# EAGLE design doorbell (EAGLE 6.3)

## Sheet 1 of 9
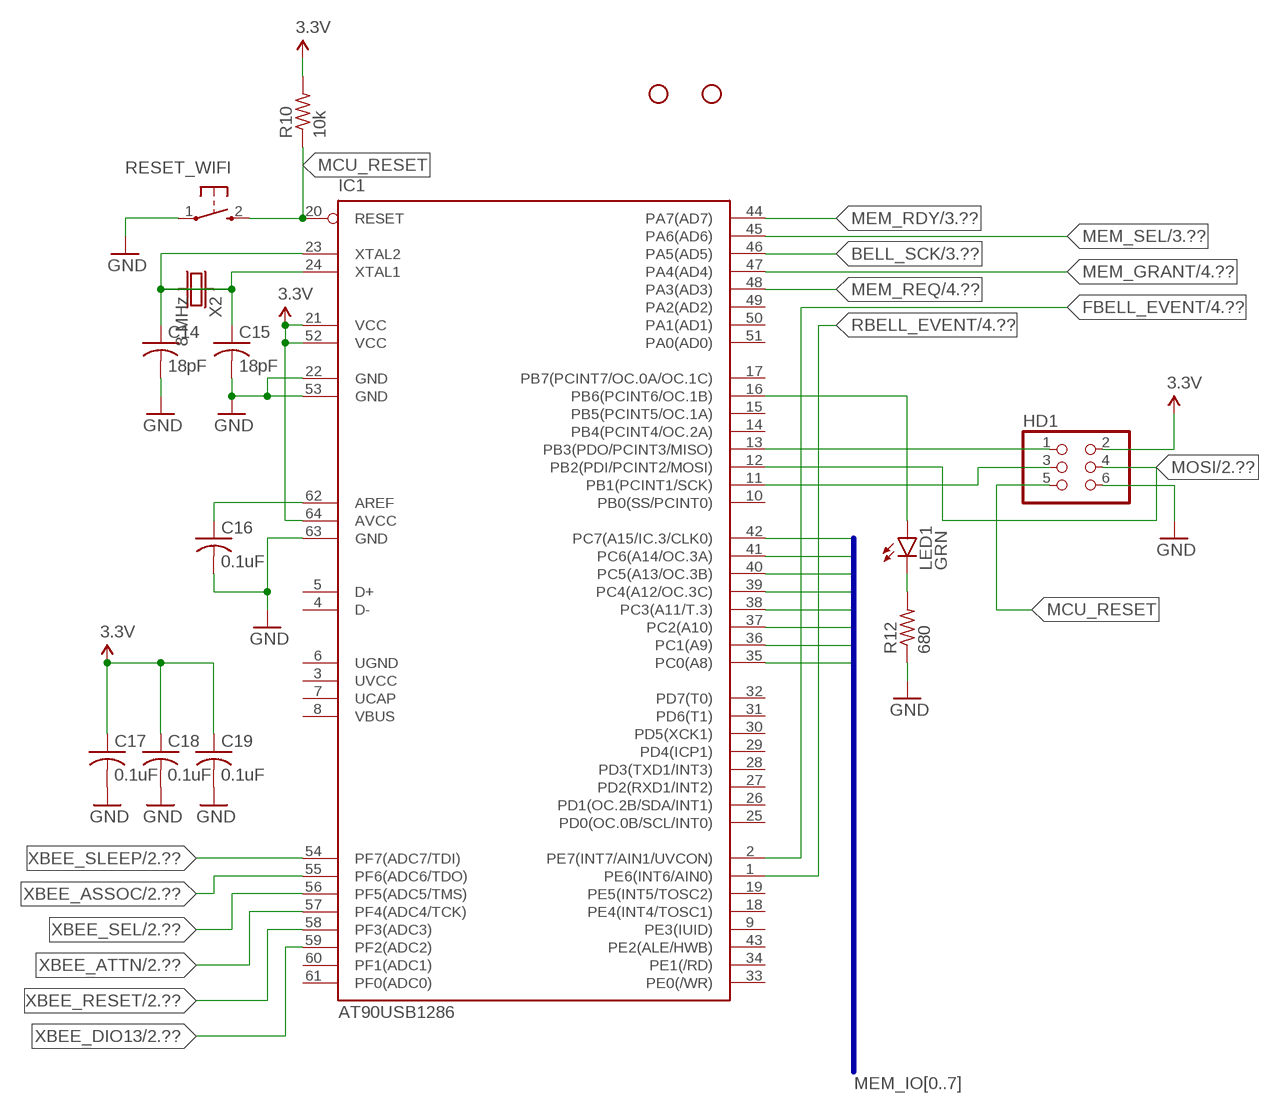
[diagram p0: schematic, sheet 1]

### Parts
C14  18pF  CAP0603  [0603_CAP]
C15  18pF  CAP0603  [0603_CAP]
C16  0.1uF  CAP0603  [0603_CAP]
C17  0.1uF  CAP0603  [0603_CAP]
C18  0.1uF  CAP0603  [0603_CAP]
C19  0.1uF  CAP0603  [0603_CAP]
HD1  HEADER_2X3  [HEADER_2X3]
IC1  AT90USB1286  [TQFP64]
JP1  STAND-OFF  [STAND-OFF]
JP3  STAND-OFF  [STAND-OFF]
LED1  GRN  LED0603  [0603_LED]
R10  10k  RESISTOR0603  [0603_RESISTOR]
R12  680  RESISTOR0603  [0603_RESISTOR]
RESET_WIFI  SWITCH  [SWITCH_TAC]
X2  8 MHz  CRYSTAL5X3  [CRYSTAL_5X3]

### Nets
3.3V: C17.1 C18.1 C19.1 HD1.2 IC1.21(VCC) IC1.52(VCC) IC1.64(AVCC) R10.2 ; also sheet 2,3,4,5,6,7,8,9
BELL_SCK: IC1.46(PA5(AD5)) ; also sheet 3,4,5
FBELL_EVENT: IC1.2(PE7(INT7/AIN1/UVCON)) ; also sheet 4
GND: C14.2 C15.2 C16.2 C17.2 C18.2 C19.2 HD1.6 IC1.22(GND) IC1.53(GND) IC1.63(GND) R12.1 RESET_WIFI.1 ; also sheet 2,3,4,5,6,7,8,9
MCU_RESET: HD1.5 IC1.20(RESET) R10.1 RESET_WIFI.2
MEM_GRANT: IC1.47(PA4(AD4)) ; also sheet 4
MEM_IO0: IC1.35(PC0(A8)) ; also sheet 3
MEM_IO1: IC1.36(PC1(A9)) ; also sheet 3
MEM_IO2: IC1.37(PC2(A10)) ; also sheet 3
MEM_IO3: IC1.38(PC3(A11/T.3)) ; also sheet 3
MEM_IO4: IC1.39(PC4(A12/OC.3C)) ; also sheet 3
MEM_IO5: IC1.40(PC5(A13/OC.3B)) ; also sheet 3
MEM_IO6: IC1.41(PC6(A14/OC.3A)) ; also sheet 3
MEM_IO7: IC1.42(PC7(A15/IC.3/CLK0)) ; also sheet 3
MEM_RDY: IC1.44(PA7(AD7)) ; also sheet 3,4
MEM_REQ: IC1.48(PA3(AD3)) ; also sheet 4
MEM_SEL: IC1.45(PA6(AD6)) ; also sheet 3,4
MISO: HD1.1 IC1.13(PB3(PDO/PCINT3/MISO)) ; also sheet 2
MOSI: HD1.4 IC1.12(PB2(PDI/PCINT2/MOSI)) ; also sheet 2
N$1: C14.1 IC1.23(XTAL2) X2.1
N$2: C15.1 IC1.24(XTAL1) X2.2
N$4: LED1.C R12.2
N$5: IC1.16(PB6(PCINT6/OC.1B)) LED1.A
N$8: C16.1 IC1.62(AREF)
RBELL_EVENT: IC1.1(PE6(INT6/AIN0)) ; also sheet 4
SCK: HD1.3 IC1.11(PB1(PCINT1/SCK)) ; also sheet 2
XBEE_ASSOC: IC1.55(PF6(ADC6/TDO)) ; also sheet 2
XBEE_ATTN: IC1.57(PF4(ADC4/TCK)) ; also sheet 2
XBEE_DIO13: IC1.59(PF2(ADC2)) ; also sheet 2
XBEE_RESET: IC1.58(PF3(ADC3)) ; also sheet 2
XBEE_SEL: IC1.56(PF5(ADC5/TMS)) ; also sheet 2
XBEE_SLEEP: IC1.54(PF7(ADC7/TDI)) ; also sheet 2
Unconnected: IC1.4(D-) IC1.5(D+) IC1.9(PE3(IUID)) IC1.10(PB0(SS/PCINT0)) IC1.14(PB4(PCINT4/OC.2A)) IC1.15(PB5(PCINT5/OC.1A)) IC1.17(PB7(PCINT7/OC.0A/OC.1C)) IC1.18(PE4(INT4/TOSC1)) IC1.19(PE5(INT5/TOSC2)) IC1.25(PD0(OC.0B/SCL/INT0)) IC1.26(PD1(OC.2B/SDA/INT1)) IC1.27(PD2(RXD1/INT2)) IC1.28(PD3(TXD1/INT3)) IC1.29(PD4(ICP1)) IC1.30(PD5(XCK1)) IC1.31(PD6(T1)) IC1.32(PD7(T0)) IC1.33(PE0(/WR)) IC1.34(PE1(/RD)) IC1.43(PE2(ALE/HWB)) IC1.49(PA2(AD2)) IC1.50(PA1(AD1)) IC1.51(PA0(AD0)) IC1.60(PF1(ADC1)) IC1.61(PF0(ADC0))

### Buses
MEM_IO[0..7]

## Sheet 2 of 9
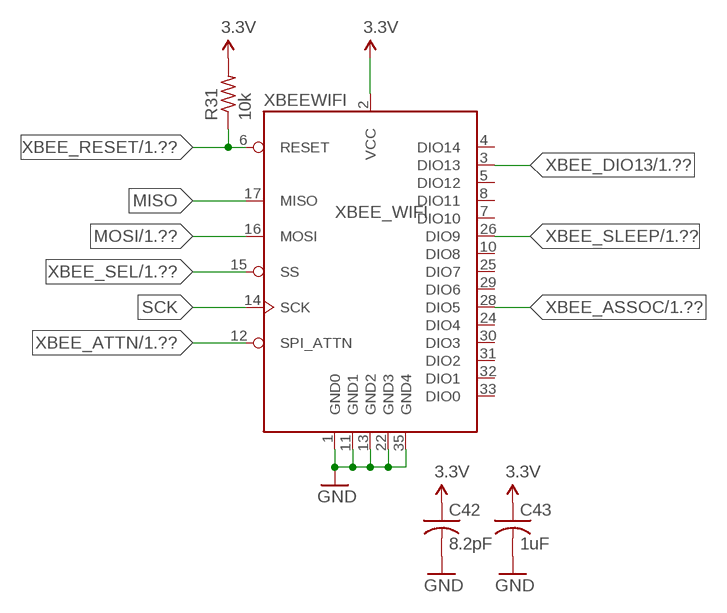
[diagram p1: schematic, sheet 2]

### Parts
C42  8.2pF  CAP0603  [0603_CAP]
C43  1uF  CAP0603  [0603_CAP]
R31  10k  RESISTOR0603  [0603_RESISTOR]
XBEEWIFI  XBEE_WIFI  [XBEE_WIFI]

### Nets
3.3V: C42.1 C43.1 R31.2 XBEEWIFI.2(VCC) ; also sheet 1,3,4,5,6,7,8,9
GND: C42.2 C43.2 XBEEWIFI.1(GND0) XBEEWIFI.11(GND1) XBEEWIFI.13(GND2) XBEEWIFI.22(GND3) XBEEWIFI.35(GND4) ; also sheet 1,3,4,5,6,7,8,9
MISO: XBEEWIFI.17(MISO) ; also sheet 1
MOSI: XBEEWIFI.16(MOSI) ; also sheet 1
SCK: XBEEWIFI.14(SCK) ; also sheet 1
XBEE_ASSOC: XBEEWIFI.28(DIO5) ; also sheet 1
XBEE_ATTN: XBEEWIFI.12(SPI_ATTN) ; also sheet 1
XBEE_DIO13: XBEEWIFI.3(DIO13) ; also sheet 1
XBEE_RESET: R31.1 XBEEWIFI.6(RESET) ; also sheet 1
XBEE_SEL: XBEEWIFI.15(SS) ; also sheet 1
XBEE_SLEEP: XBEEWIFI.26(DIO9) ; also sheet 1
Unconnected: XBEEWIFI.4(DIO14) XBEEWIFI.5(DIO12) XBEEWIFI.7(DIO10) XBEEWIFI.8(DIO11) XBEEWIFI.10(DIO8) XBEEWIFI.24(DIO4) XBEEWIFI.25(DIO7) XBEEWIFI.29(DIO6) XBEEWIFI.30(DIO3) XBEEWIFI.31(DIO2) XBEEWIFI.32(DIO1) XBEEWIFI.33(DIO0)

## Sheet 3 of 9
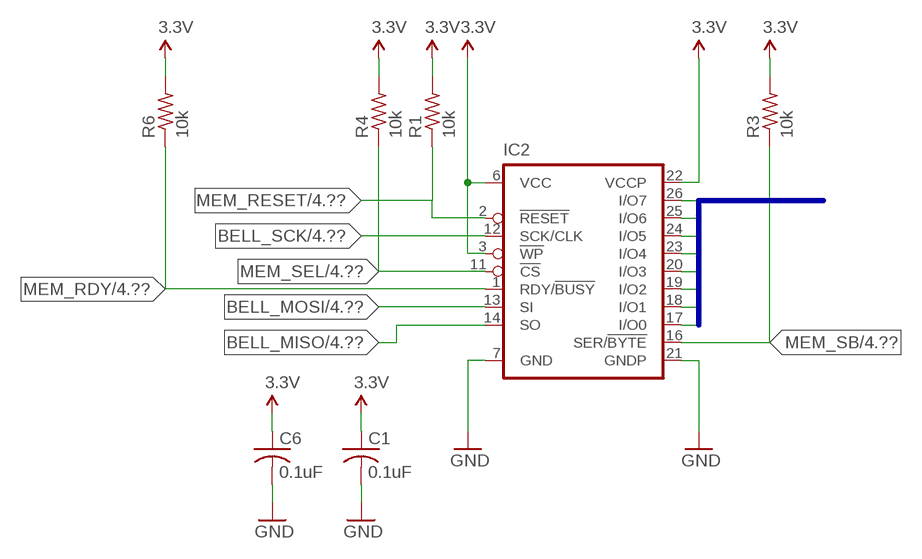
[diagram p2: schematic, sheet 3]

### Parts
C1  0.1uF  CAP0603  [0603_CAP]
C6  0.1uF  CAP0603  [0603_CAP]
IC2  AT45DB642D  [28T-TSOP-1]
R1  10k  RESISTOR0603  [0603_RESISTOR]
R3  10k  RESISTOR0603  [0603_RESISTOR]
R4  10k  RESISTOR0603  [0603_RESISTOR]
R6  10k  RESISTOR0603  [0603_RESISTOR]

### Nets
3.3V: C1.1 C6.1 IC2.3(!WP) IC2.6(VCC) IC2.22(VCCP) R1.2 R3.2 R4.2 R6.2 ; also sheet 1,2,4,5,6,7,8,9
BELL_MISO: IC2.14(SO) ; also sheet 4,5
BELL_MOSI: IC2.13(SI) ; also sheet 4,5
BELL_SCK: IC2.12(SCK/CLK) ; also sheet 1,4,5
GND: C1.2 C6.2 IC2.7(GND) IC2.21(GNDP) ; also sheet 1,2,4,5,6,7,8,9
MEM_IO0: IC2.17(I/O0) ; also sheet 1
MEM_IO1: IC2.18(I/O1) ; also sheet 1
MEM_IO2: IC2.19(I/O2) ; also sheet 1
MEM_IO3: IC2.20(I/O3) ; also sheet 1
MEM_IO4: IC2.23(I/O4) ; also sheet 1
MEM_IO5: IC2.24(I/O5) ; also sheet 1
MEM_IO6: IC2.25(I/O6) ; also sheet 1
MEM_IO7: IC2.26(I/O7) ; also sheet 1
MEM_RDY: IC2.1(RDY/!BUSY) R6.1 ; also sheet 1,4
MEM_RESET: IC2.2(!RESET) R1.1 ; also sheet 4
MEM_SB: IC2.16(SER/!BYTE) R3.1 ; also sheet 4
MEM_SEL: IC2.11(!CS) R4.1 ; also sheet 1,4

### Buses
MEM_IO[0..7]

## Sheet 4 of 9
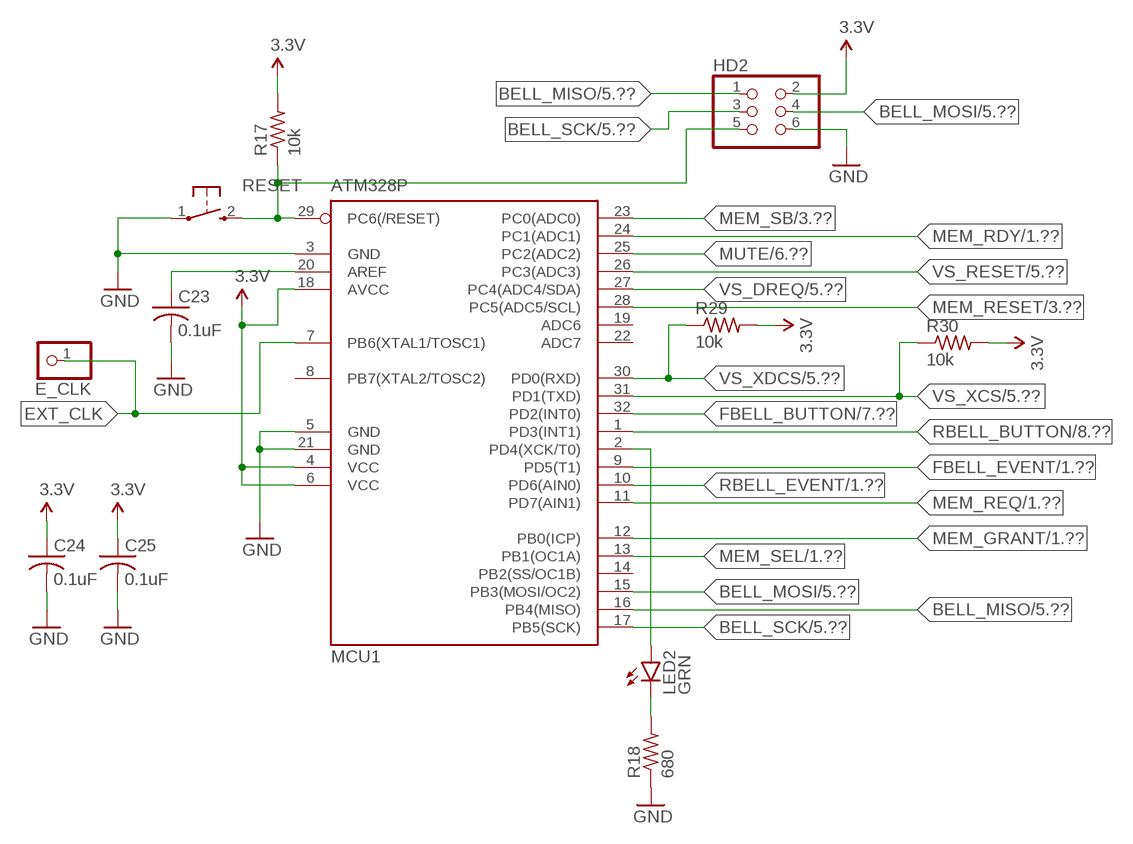
[diagram p3: schematic, sheet 4]

### Parts
C23  0.1uF  CAP0603  [0603_CAP]
C24  0.1uF  CAP0603  [0603_CAP]
C25  0.1uF  CAP0603  [0603_CAP]
E_CLK  PINHD-1X1  [1X01]
HD2  HEADER_2X3  [HEADER_2X3]
LED2  GRN  LED0603  [0603_LED]
MCU1  ATM328P  ATMEGA328P  [TQFP32-08]
R17  10k  RESISTOR0603  [0603_RESISTOR]
R18  680  RESISTOR0603  [0603_RESISTOR]
R29  10k  RESISTOR0603  [0603_RESISTOR]
R30  10k  RESISTOR0603  [0603_RESISTOR]
RESET  SWITCH  [SWITCH_TAC]

### Nets
3.3V: C24.1 C25.1 HD2.2 MCU1.4(VCC) MCU1.6(VCC) MCU1.18(AVCC) R17.2 R29.2 R30.2 ; also sheet 1,2,3,5,6,7,8,9
BELL_MISO: HD2.1 MCU1.16(PB4(MISO)) ; also sheet 3,5
BELL_MOSI: HD2.4 MCU1.15(PB3(MOSI/OC2)) ; also sheet 3,5
BELL_RESET: HD2.5 MCU1.29(PC6(/RESET)) R17.1 RESET.2
BELL_SCK: HD2.3 MCU1.17(PB5(SCK)) ; also sheet 1,3,5
EXT_CLK: E_CLK.1 MCU1.7(PB6(XTAL1/TOSC1))
FBELL_BUTTON: MCU1.32(PD2(INT0)) ; also sheet 7
FBELL_EVENT: MCU1.9(PD5(T1)) ; also sheet 1
GND: C23.2 C24.2 C25.2 HD2.6 MCU1.3(GND) MCU1.5(GND) MCU1.21(GND) R18.1 RESET.1 ; also sheet 1,2,3,5,6,7,8,9
MEM_GRANT: MCU1.12(PB0(ICP)) ; also sheet 1
MEM_RDY: MCU1.24(PC1(ADC1)) ; also sheet 1,3
MEM_REQ: MCU1.11(PD7(AIN1)) ; also sheet 1
MEM_RESET: MCU1.28(PC5(ADC5/SCL)) ; also sheet 3
MEM_SB: MCU1.23(PC0(ADC0)) ; also sheet 3
MEM_SEL: MCU1.13(PB1(OC1A)) ; also sheet 1,3
MUTE: MCU1.25(PC2(ADC2)) ; also sheet 6
N$7: C23.1 MCU1.20(AREF)
N$17: LED2.C R18.2
N$18: LED2.A MCU1.2(PD4(XCK/T0))
RBELL_BUTTON: MCU1.1(PD3(INT1)) ; also sheet 8
RBELL_EVENT: MCU1.10(PD6(AIN0)) ; also sheet 1
VS_DREQ: MCU1.27(PC4(ADC4/SDA)) ; also sheet 5
VS_RESET: MCU1.26(PC3(ADC3)) ; also sheet 5
VS_XCS: MCU1.31(PD1(TXD)) R30.1 ; also sheet 5
VS_XDCS: MCU1.30(PD0(RXD)) R29.1 ; also sheet 5
Unconnected: MCU1.8(PB7(XTAL2/TOSC2)) MCU1.14(PB2(SS/OC1B)) MCU1.19(ADC6) MCU1.22(ADC7)

## Sheet 5 of 9
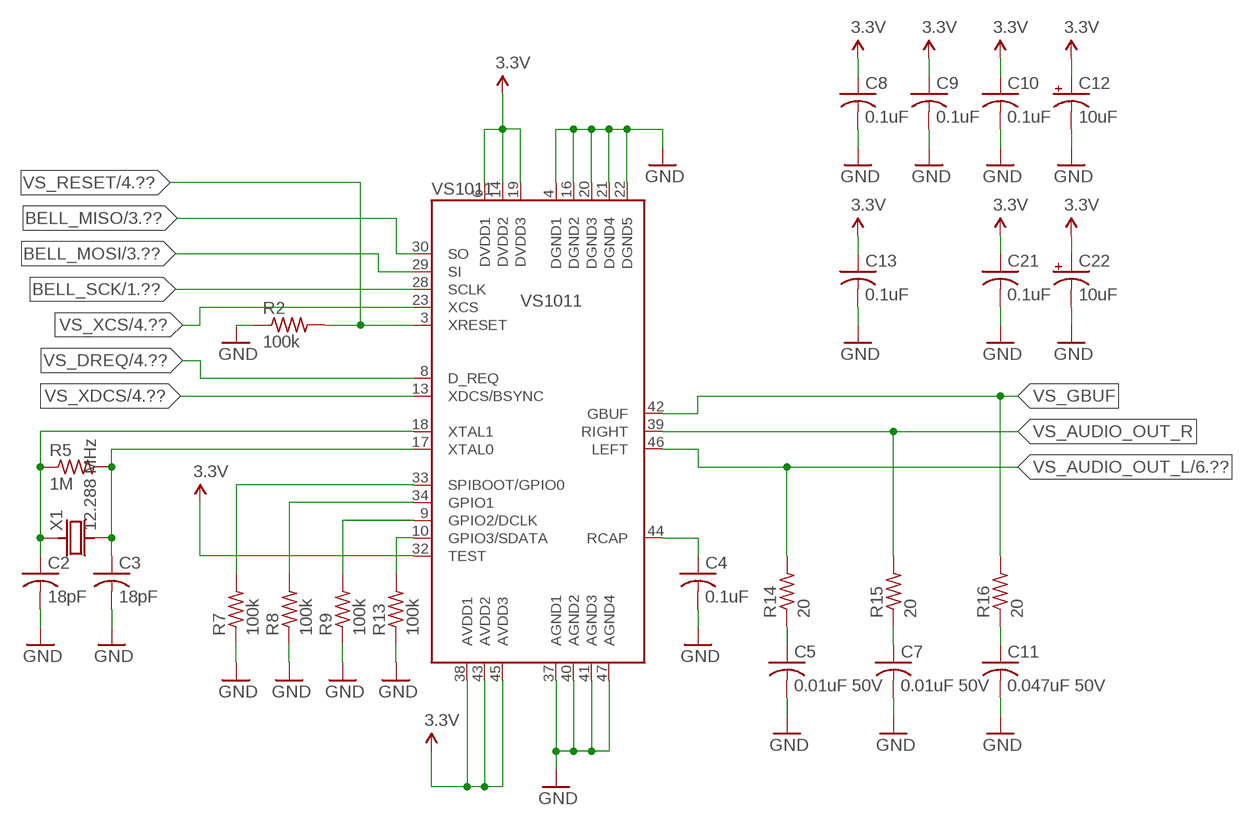
[diagram p4: schematic, sheet 5]

### Parts
C2  18pF  CAP0603  [0603_CAP]
C3  18pF  CAP0603  [0603_CAP]
C4  0.1uF  CAP0603  [0603_CAP]
C5  0.01uF 50V  CAP0603  [0603_CAP]
C7  0.01uF 50V  CAP0603  [0603_CAP]
C8  0.1uF  CAP0603  [0603_CAP]
C9  0.1uF  CAP0603  [0603_CAP]
C10  0.1uF  CAP0603  [0603_CAP]
C11  0.047uF 50V  CAP0603  [0603_CAP]
C12  10uF  CAP_POLB  [B_CAP]
C13  0.1uF  CAP0603  [0603_CAP]
C21  0.1uF  CAP0603  [0603_CAP]
C22  10uF  CAP_POLB  [B_CAP]
R2  100k  RESISTOR0603  [0603_RESISTOR]
R5  1M  RESISTOR0603  [0603_RESISTOR]
R7  100k  RESISTOR0603  [0603_RESISTOR]
R8  100k  RESISTOR0603  [0603_RESISTOR]
R9  100k  RESISTOR0603  [0603_RESISTOR]
R13  100k  RESISTOR0603  [0603_RESISTOR]
R14  20  RESISTOR0603  [0603_RESISTOR]
R15  20  RESISTOR0603  [0603_RESISTOR]
R16  20  RESISTOR0603  [0603_RESISTOR]
VS1011  VS1011  [LQFP-48]
X1  12.288 MHz  CRYSTAL5X3  [CRYSTAL_5X3]

### Nets
3.3V: C8.1 C9.1 C10.1 C12.+ C13.1 C21.1 C22.+ VS1011.6(DVDD1) VS1011.14(DVDD2) VS1011.19(DVDD3) VS1011.32(TEST) VS1011.38(AVDD1) VS1011.43(AVDD2) VS1011.45(AVDD3) ; also sheet 1,2,3,4,6,7,8,9
BELL_MISO: VS1011.30(SO) ; also sheet 3,4
BELL_MOSI: VS1011.29(SI) ; also sheet 3,4
BELL_SCK: VS1011.28(SCLK) ; also sheet 1,3,4
GND: C2.2 C3.2 C4.2 C5.2 C7.2 C8.2 C9.2 C10.2 C11.2 C12.- C13.2 C21.2 C22.- R2.1 R7.1 R8.1 R9.1 R13.1 VS1011.4(DGND1) VS1011.16(DGND2) VS1011.20(DGND3) VS1011.21(DGND4) VS1011.22(DGND5) VS1011.37(AGND1) VS1011.40(AGND2) VS1011.41(AGND3) VS1011.47(AGND4) ; also sheet 1,2,3,4,6,7,8,9
N$28: C2.1 R5.1 VS1011.18(XTAL1) X1.1
N$29: C3.1 R5.2 VS1011.17(XTAL0) X1.2
N$30: C4.1 VS1011.44(RCAP)
N$32: R13.2 VS1011.10(GPIO3/SDATA)
N$33: R9.2 VS1011.9(GPIO2/DCLK)
N$34: R8.2 VS1011.34(GPIO1)
N$35: R7.2 VS1011.33(SPIBOOT/GPIO0)
N$41: C5.1 R14.1
N$42: C7.1 R15.1
N$43: C11.1 R16.1
VS_AUDIO_OUT_L: R14.2 VS1011.46(LEFT) ; also sheet 6
VS_AUDIO_OUT_R: R15.2 VS1011.39(RIGHT)
VS_DREQ: VS1011.8(D_REQ) ; also sheet 4
VS_GBUF: R16.2 VS1011.42(GBUF)
VS_RESET: R2.2 VS1011.3(XRESET) ; also sheet 4
VS_XCS: VS1011.23(XCS) ; also sheet 4
VS_XDCS: VS1011.13(XDCS/BSYNC) ; also sheet 4

## Sheet 6 of 9
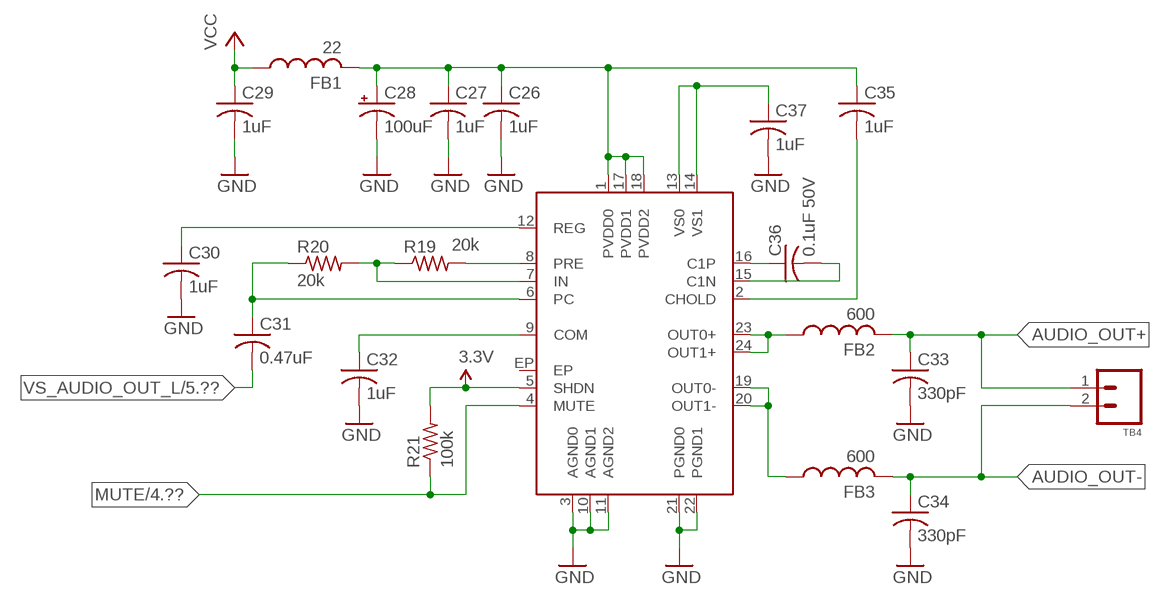
[diagram p5: schematic, sheet 6]

### Parts
C26  1uF  CAP0805  [0805_CAP]
C27  1uF  CAP0805  [0805_CAP]
C28  100uF  CAP_POLF  [F_CAP]
C29  1uF  CAP0805  [0805_CAP]
C30  1uF  CAP0603  [0603_CAP]
C31  0.47uF  CAP0603  [0603_CAP]
C32  1uF  CAP0603  [0603_CAP]
C33  330pF  CAP0603  [0603_CAP]
C34  330pF  CAP0603  [0603_CAP]
C35  1uF  CAP0805  [0805_CAP]
C36  0.1uF 50V  CAP0603  [0603_CAP]
C37  1uF  CAP0603  [0603_CAP]
FB1  22  FB0805  [0805_FB]
FB2  600  FB0805  [0805_FB]
FB3  600  FB0805  [0805_FB]
MAX1  MAX9737  [TQFN24]
R19  20k  RESISTOR0603  [0603_RESISTOR]
R20  20k  RESISTOR0603  [0603_RESISTOR]
R21  100k  RESISTOR0603  [0603_RESISTOR]
TB4  TERMINAL_BLOCK_2  [TERMINAL_BLOCK_2]

### Nets
3.3V: MAX1.5(SHDN) R21.2 ; also sheet 1,2,3,4,5,7,8,9
AUDIO_OUT+: C33.1 FB2.2 TB4.1
AUDIO_OUT-: C34.1 FB3.2 TB4.2
GND: C26.2 C27.2 C28.- C29.2 C30.2 C32.2 C33.2 C34.2 C37.2 MAX1.3(AGND0) MAX1.10(AGND1) MAX1.11(AGND2) MAX1.21(PGND0) MAX1.22(PGND1) ; also sheet 1,2,3,4,5,7,8,9
MUTE: MAX1.4(MUTE) R21.1 ; also sheet 4
N$3: C26.1 C27.1 C28.+ C35.1 FB1.2 MAX1.1(PVDD0) MAX1.17(PVDD1) MAX1.18(PVDD2)
N$12: C30.1 MAX1.12(REG)
N$14: MAX1.8(PRE) R19.2
N$15: MAX1.7(IN) R19.1 R20.2
N$16: C31.1 MAX1.6(PC) R20.1
N$19: C32.1 MAX1.9(COM)
N$20: FB3.1 MAX1.19(OUT0-) MAX1.20(OUT1-)
N$21: FB2.1 MAX1.23(OUT0+) MAX1.24(OUT1+)
N$22: C35.2 MAX1.2(CHOLD)
N$23: C36.1 MAX1.16(C1P)
N$24: C36.2 MAX1.15(C1N)
N$25: C37.1 MAX1.13(VS0) MAX1.14(VS1)
VCC: C29.1 FB1.1 ; also sheet 9
VS_AUDIO_OUT_L: C31.2 ; also sheet 5
Unconnected: MAX1.EP

## Sheet 7 of 9
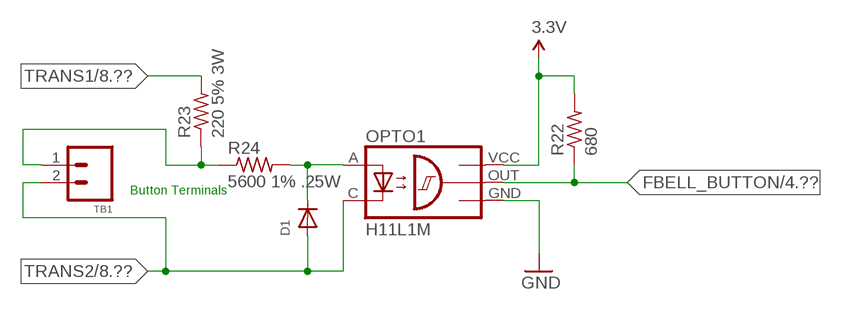
[diagram p6: schematic, sheet 7]

### Parts
D1  DIODE0603  [0603_DIODE]
OPTO1  H11L1M  [SOIC6]
R22  680  RESISTOR0603  [0603_RESISTOR]
R23  220 5% 3W  RESISTOR4122  [4122_RESISTOR]
R24  5600 1% .25W  RESISTOR1206  [1206_RESISTOR]
TB1  TERMINAL_BLOCK_2  [TERMINAL_BLOCK_2]

### Nets
3.3V: OPTO1.VCC R22.2 ; also sheet 1,2,3,4,5,6,8,9
FBELL_BUTTON: OPTO1.OUT R22.1 ; also sheet 4
GND: OPTO1.GND ; also sheet 1,2,3,4,5,6,8,9
N$26: D1.C OPTO1.A R24.2
N$37: R23.1 R24.1 TB1.1
TRANS1: R23.2 ; also sheet 8,9
TRANS2: D1.A OPTO1.C TB1.2 ; also sheet 8,9

### Notes on the sheet
- Button Terminals

## Sheet 8 of 9
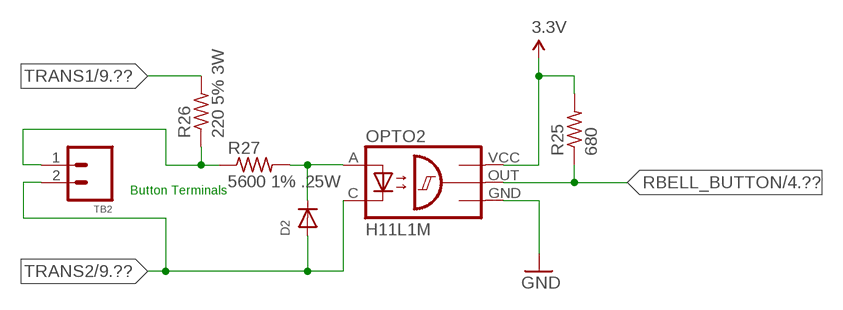
[diagram p7: schematic, sheet 8]

### Parts
D2  DIODE0603  [0603_DIODE]
OPTO2  H11L1M  [SOIC6]
R25  680  RESISTOR0603  [0603_RESISTOR]
R26  220 5% 3W  RESISTOR4122  [4122_RESISTOR]
R27  5600 1% .25W  RESISTOR1206  [1206_RESISTOR]
TB2  TERMINAL_BLOCK_2  [TERMINAL_BLOCK_2]

### Nets
3.3V: OPTO2.VCC R25.2 ; also sheet 1,2,3,4,5,6,7,9
GND: OPTO2.GND ; also sheet 1,2,3,4,5,6,7,9
N$27: D2.C OPTO2.A R27.2
N$39: R26.1 R27.1 TB2.1
RBELL_BUTTON: OPTO2.OUT R25.1 ; also sheet 4
TRANS1: R26.2 ; also sheet 7,9
TRANS2: D2.A OPTO2.C TB2.2 ; also sheet 7,9

### Notes on the sheet
- Button Terminals

## Sheet 9 of 9
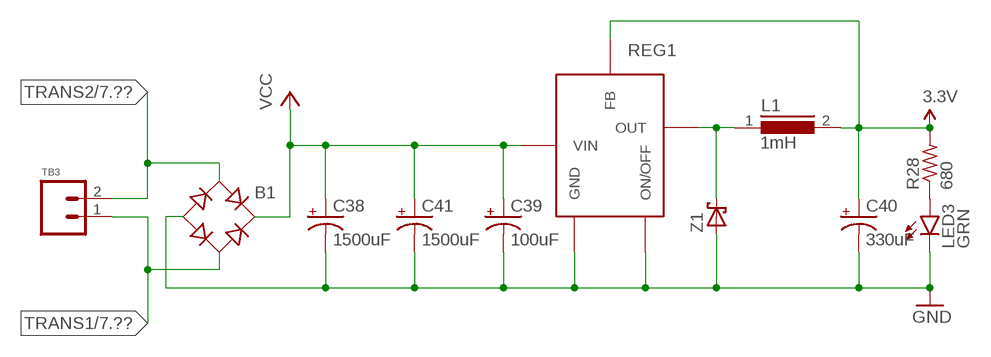
[diagram p8: schematic, sheet 9]

### Parts
B1  BR  [DFS]
C38  1500uF  CAP_POLJ16  [J16_CAP]
C39  100uF  CAP_POLF  [F_CAP]
C40  330uF  CAP_POLF  [F_CAP]
C41  1500uF  CAP_POLJ16  [J16_CAP]
L1  1mH  DR125  [DR125]
LED3  GRN  LED0603  [0603_LED]
R28  680  RESISTOR0603  [0603_RESISTOR]
REG1  TL2575  [TO-263-5]
TB3  TERMINAL_BLOCK_2  [TERMINAL_BLOCK_2]
Z1  SCHOTTKY_DIODE  [SMD_DIODE]

### Nets
3.3V: C40.+ L1.2 R28.2 REG1.4(FB) ; also sheet 1,2,3,4,5,6,7,8
GND: B1.- C38.- C39.- C40.- C41.- LED3.C REG1.3(GND) REG1.5(ON/OFF) Z1.A ; also sheet 1,2,3,4,5,6,7,8
N$31: L1.1 REG1.2(OUT) Z1.C
N$36: LED3.A R28.1
TRANS1: B1.AC2 TB3.1 ; also sheet 7,8
TRANS2: B1.AC1 TB3.2 ; also sheet 7,8
VCC: B1.+ C38.+ C39.+ C41.+ REG1.1(VIN) ; also sheet 6

## Power pins joined to a net without a drawn wire
UCAP: IC1.7(UCAP)
UGND: IC1.6(UGND)
UVCC: IC1.3(UVCC)
VBUS: IC1.8(VBUS)

## Library data of the parts
B1 = jkf:BR; DIGIKEY#: 641-1425-1-ND; MANF: Comchip Technology; MANF#: DF206ST-G
C1-C11 C13-C19 C21 C23-C27 C29-C37 C42 C43 = jkf:CAP
C12 C22 C28 C38-C41 = jkf:CAP_POL
D1 D2 = jkf:DIODE; DIGIKEY#: 641-1002-1-ND; MANF: Comchip Technology; MANF#: CDSU101A
E_CLK = pinhead:PINHD-1X1: PIN HEADER
FB1-FB3 = jkf:FB
HD1 HD2 = jkf:HEADER_2X3; DIGIKEY#: 609-3487-1-ND; MANF: FCI; MANF#: 95278-101A06LF
IC1 = jkf:AT90USB1286; DIGIKEY#: AT90USB1286-AURCT-ND; MANF: Atmel; MANF#: AT90USB1286-AUR
IC2 = jkf:AT45DB642D; DIGIKEY#: 1265-1010-ND; MANF: Adesto Technologies; MANF#: AT45DB642D-TU
JP1 JP3 = SparkFun-Electromechanical:STAND-OFF: #4 Stand Off This is the mechanical footprint for a #4 phillips button head screw. Use the keepout ring to avoid running the screw head into surrounding components. SKU : PRT-00447
L1 = jkf:DR125; DIGIKEY#: SRR1208-102KLCT-ND; MANF: Bourns Inc.; MANF#: SRR1208-102KL
LED1-LED3 = jkf:LED; DIGIKEY#: 516-2493-1-ND; MANF: Avago Technologies; MANF#: HSMG-C191
MAX1 = jkf:MAX9737; DIGIKEY#: MAX9737ETG+TCT-ND; MANF: Maxim; MANF#: MAX9737ETG+T
MCU1 = jkf:ATMEGA328P; DIGIKEY#: ATMEGA328P-AURCT-ND; MANF: Atmel; MANF#: ATMEGA328P-AUR
OPTO1 OPTO2 = jkf:H11L1M; DIGIKEY#: H11L1SM-ND; MANF: Fairchild Semiconductor; MANF#: H11L1SM
R1-R10 R12-R31 = jkf:RESISTOR
REG1 = jkf:TL2575; DIGIKEY#: 296-21828-1-ND; MANF: Texas Instruments; MANF#: TL2575-33IKTTR
RESET RESET_WIFI = jkf:SWITCH; DIGIKEY#: EG4576CT-ND; MANF: E-Switch; MANF#: TL3302AF180QJ
TB1-TB4 = jkf:TERMINAL_BLOCK_2; DIGIKEY#: 277-2072-1-ND; MANF: Phoenix; MANF#: 1771091
VS1011 = jkf:VS1011; MANF: VLSI; MANF#: VS1011E-L
X1 X2 = jkf:CRYSTAL
XBEEWIFI = jkf:XBEE_WIFI; DIGIKEY#: 602-1369-ND; MANF: Digi International; MANF#: XB2B-WFPS-001
Z1 = jkf:SCHOTTKY_DIODE; DIGIKEY#: 1N5819HW-FDICT-ND; MANF: Diodes Inc; MANF#: 1N5819HW-7-F

## Board
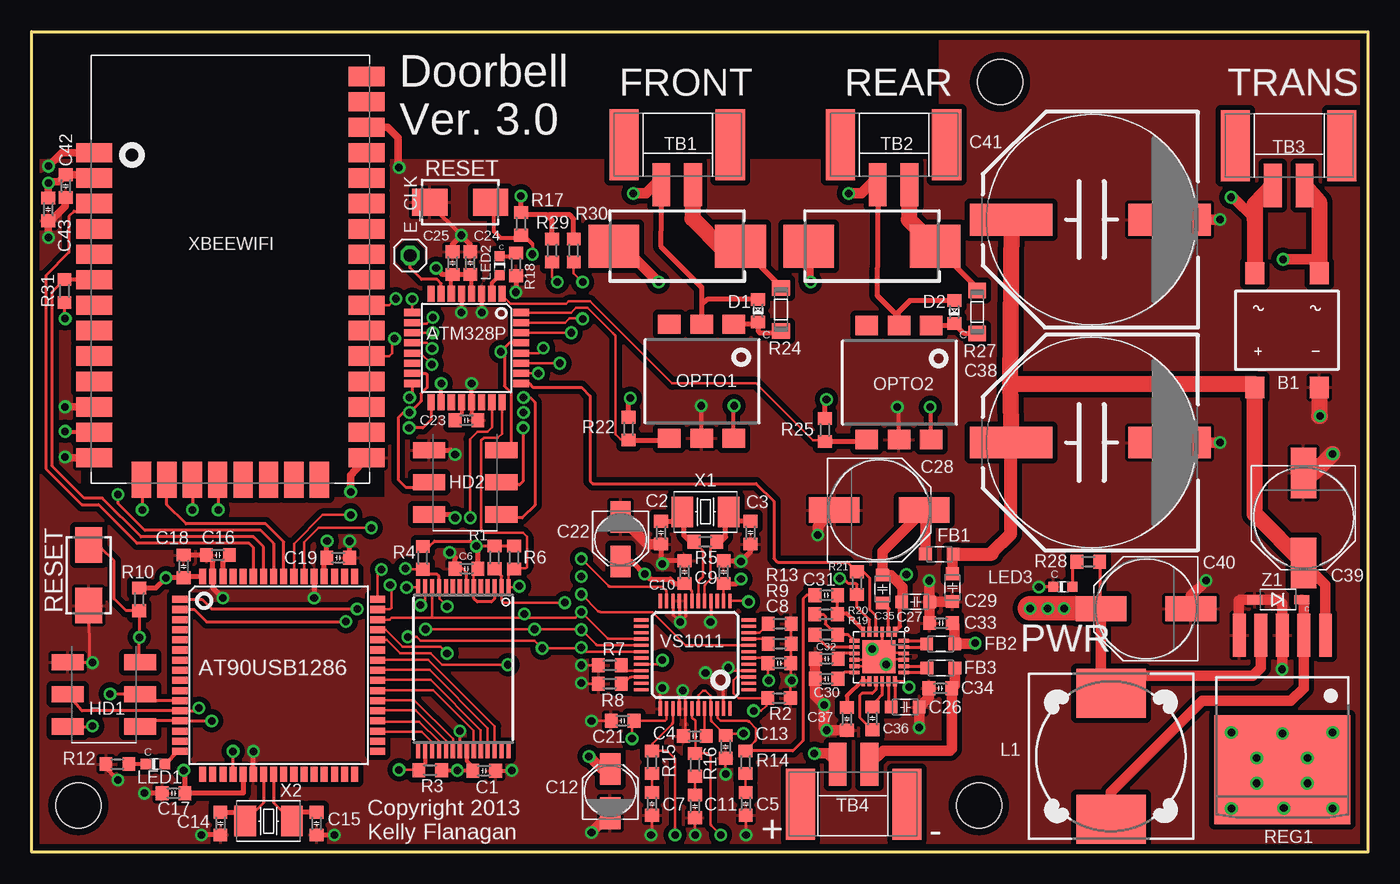
[diagram p9: board, top side]
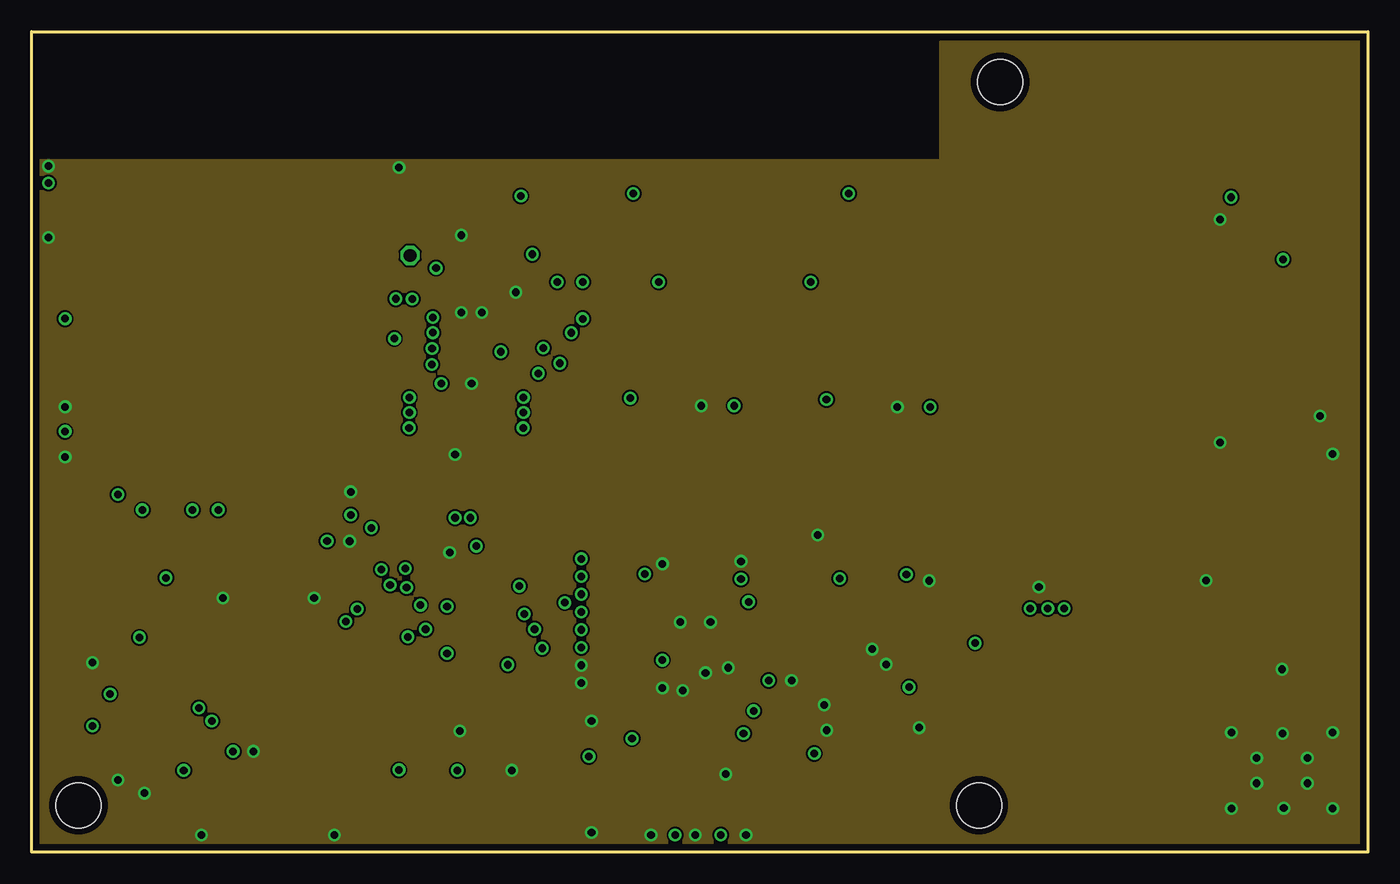
[diagram p10: board, inner layer GND]
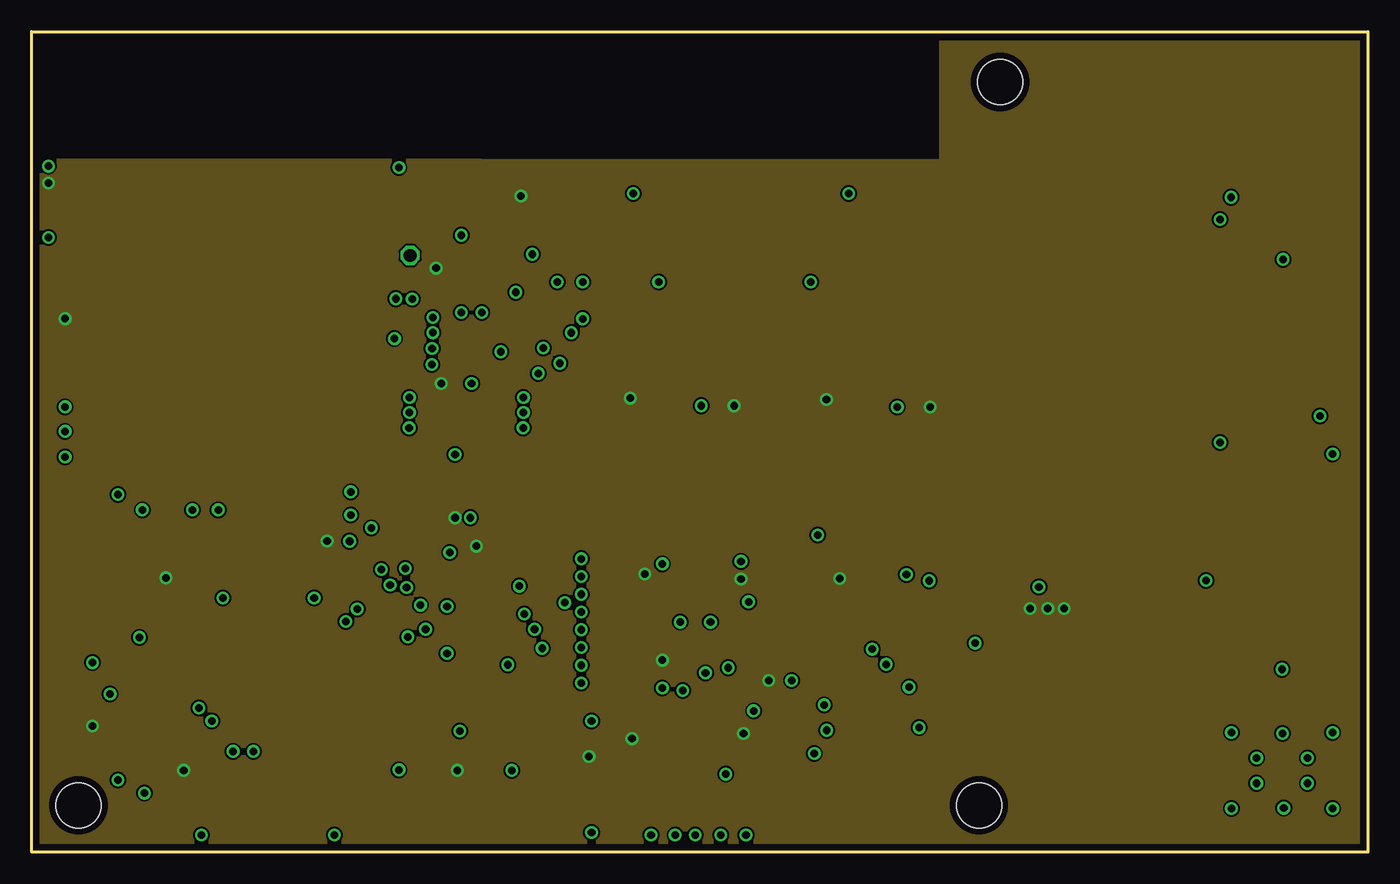
[diagram p11: board, inner layer 3.3V]
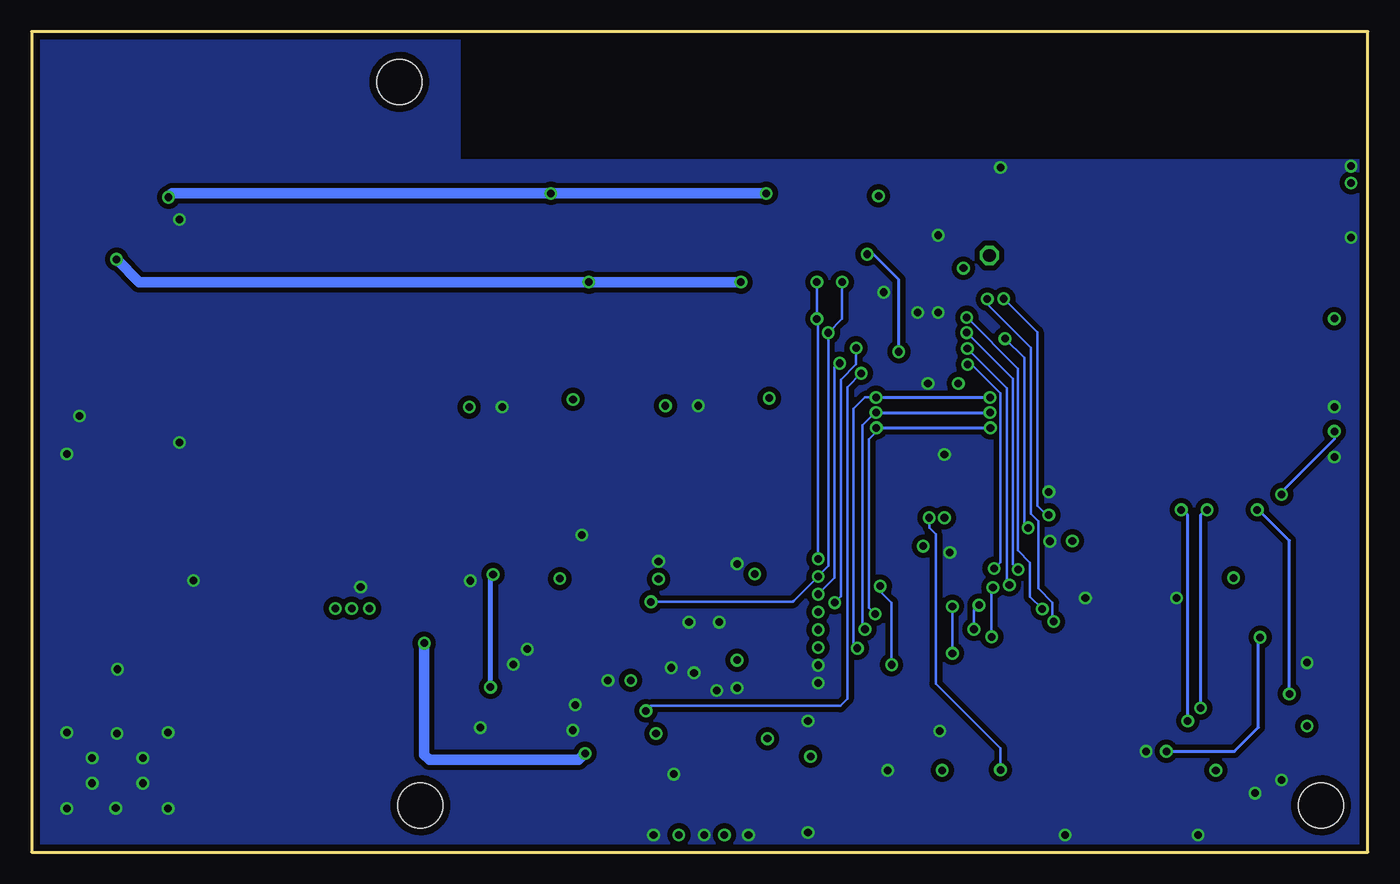
[diagram p12: board, bottom side, seen from below]

Size 105.51 x 64.77 mm. Coordinates in mm from the lower left corner, seen from the top.
Outline: 0,0 0,64.77 105.51,64.77 105.51,0 0,0
Copper layers (1+2*15+16): Top 0.0178mm / dielectric 12mil / GND 0.0356mm / dielectric 28mil / 3.3V 0.0356mm / dielectric 12mil / Bottom 0.0178mm
Design rules "SSC-EAGLE-4Lyr_v1.0.0.3": minimum track width 6mil, minimum drill 8mil, track to track 6mil, track to pad 6mil, pad to pad 6mil, via to via 6mil, smd to smd 6mil, copper to edge 20mil, drill to drill 16mil, minimum pad ring 8mil, minimum via ring 8mil, stop-mask expansion 3mil, vias tented up to drill 0mil, thermal gap 10mil

### Footprints (pad centres in the part's own frame; a part is rotated, then mirrored left to right if it is on the bottom)
DFS = smd 1.7 x 1.5: + -4.5,2.55; - -4.5,-2.55; AC1 4.5,2.55; AC2 4.5,-2.55
0603_CAP = smd 1 x 1.1: 1 -0.9,0; 2 0.9,0
B_CAP = smd 2.5 x 1.6: + 1.75,0; - -1.75,0
0805_CAP = smd 1 x 1: 1 -1.105,0; 2 1.095,0
F_CAP = smd 4 x 2: + 3.55,0; - -3.55,0
J16_CAP = smd 6.5 x 2.5: + 6.248,0; - -6.252,0
0603_DIODE = smd 1 x 1.1: A 0.9,0; C -0.9,0
1X01 = drill 1.016 octagon: 1 0,0
0805_FB = smd 1 x 1: 1 -1.1,0; 2 1.1,0
HEADER_2X3 = smd 1.27 x 2.54: 1 -2.54,-2.853; 2 -2.54,2.862; 3 0,-2.853; 4 0,2.862; 5 2.54,-2.853; 6 2.54,2.862
TQFP64 = smd 1.194 x 0.559: 1 -7.8,6; 2 -7.8,5.2; 3 -7.8,4.4; 4 -7.8,3.6; 5 -7.8,2.8; 6 -7.8,2; 7 -7.8,1.2; 8 -7.8,0.4; 9 -7.8,-0.4; 10 -7.8,-1.2; 11 -7.8,-2; 12 -7.8,-2.8; 13 -7.8,-3.6; 14 -7.8,-4.4; 15 -7.8,-5.2; 16 -7.8,-6; 33 7.8,-6; 34 7.8,-5.2; 35 7.8,-4.4; 36 7.8,-3.6; 37 7.8,-2.8; 38 7.8,-2; 39 7.8,-1.2; 40 7.8,-0.4; 41 7.8,0.4; 42 7.8,1.2; 43 7.8,2; 44 7.8,2.8; 45 7.8,3.6; 46 7.8,4.4; 47 7.8,5.2; 48 7.8,6 | smd 0.559 x 1.194: 17 -6,-7.8; 18 -5.2,-7.8; 19 -4.4,-7.8; 20 -3.6,-7.8; 21 -2.8,-7.8; 22 -2,-7.8; 23 -1.2,-7.8; 24 -0.4,-7.8; 25 0.4,-7.8; 26 1.2,-7.8; 27 2,-7.8; 28 2.8,-7.8; 29 3.6,-7.8; 30 4.4,-7.8; 31 5.2,-7.8; 32 6,-7.8; 49 6,7.8; 50 5.2,7.8; 51 4.4,7.8; 52 3.6,7.8; 53 2.8,7.8; 54 2,7.8; 55 1.2,7.8; 56 0.4,7.8; 57 -0.4,7.8; 58 -1.2,7.8; 59 -2,7.8; 60 -2.8,7.8; 61 -3.6,7.8; 62 -4.4,7.8; 63 -5.2,7.8; 64 -6,7.8
28T-TSOP-1 = smd 1.2 x 0.33: 1 -6.45,3.575; 2 -6.45,3.025; 3 -6.45,2.475; 4 -6.45,1.925; 5 -6.45,1.375; 6 -6.45,0.825; 7 -6.45,0.275; 8 -6.45,-0.275; 9 -6.45,-0.825; 10 -6.45,-1.375; 11 -6.45,-1.925; 12 -6.45,-2.475; 13 -6.45,-3.025; 14 -6.45,-3.575; 15 6.45,-3.575; 16 6.45,-3.025; 17 6.45,-2.475; 18 6.45,-1.925; 19 6.45,-1.375; 20 6.45,-0.825; 21 6.45,-0.275; 22 6.45,0.275; 23 6.45,0.825; 24 6.45,1.375; 25 6.45,1.925; 26 6.45,2.475; 27 6.45,3.025; 28 6.45,3.575
STAND-OFF = hole 3.581: 0,0
DR125 = smd 3.85 x 5.5: 1 -4.975,0; 2 4.975,0
0603_LED = smd 0.8 x 0.8: A 0.75,0; C -0.75,0
TQFN24 = smd 0.8 x 0.3: 1 -1.95,1.25; 2 -1.95,0.75; 3 -1.95,0.25; 4 -1.95,-0.25; 5 -1.95,-0.75; 6 -1.95,-1.25; 13 1.95,-1.25; 14 1.95,-0.75; 15 1.95,-0.25; 16 1.95,0.25; 17 1.95,0.75; 18 1.95,1.25 | smd 0.3 x 0.8: 7 -1.25,-1.95; 8 -0.75,-1.95; 9 -0.25,-1.95; 10 0.25,-1.95; 11 0.75,-1.95; 12 1.25,-1.95; 19 1.25,1.95; 20 0.75,1.95; 21 0.25,1.95; 22 -0.25,1.95; 23 -0.75,1.95; 24 -1.25,1.95 | smd 2.6 x 2.6: EP 0,0
TQFP32-08 = smd 1.27 x 0.559: 1 -4.293,2.8; 2 -4.293,2; 3 -4.293,1.2; 4 -4.293,0.4; 5 -4.293,-0.4; 6 -4.293,-1.2; 7 -4.293,-2; 8 -4.293,-2.8; 17 4.293,-2.8; 18 4.293,-2; 19 4.293,-1.2; 20 4.293,-0.4; 21 4.293,0.4; 22 4.293,1.2; 23 4.293,2; 24 4.293,2.8 | smd 0.559 x 1.27: 9 -2.8,-4.293; 10 -2,-4.293; 11 -1.2,-4.293; 12 -0.4,-4.293; 13 0.4,-4.293; 14 1.2,-4.293; 15 2,-4.293; 16 2.8,-4.293; 25 2.8,4.293; 26 2,4.293; 27 1.2,4.293; 28 0.4,4.293; 29 -0.4,4.293; 30 -1.2,4.293; 31 -2,4.293; 32 -2.8,4.293
SOIC6 = smd 1.52 x 1.78: A -4.5,2.55; C -4.5,0.01; GND 4.5,0.01; NC -4.5,-2.53; OUT 4.5,-2.53; VCC 4.5,2.55
0603_RESISTOR = smd 1 x 1.1: 1 -0.9,0; 2 0.9,0
4122_RESISTOR = smd 4 x 3.4: 1 -5,0; 2 5,0
1206_RESISTOR = smd 1.2 x 1.4: 1 -1.7,0; 2 1.7,0
TO-263-5 = smd 1 x 3.4: 1 -3.4,-8; 2 -1.7,-8; 3 0,-8; 4 1.7,-8; 5 3.4,-8 | smd 10.7 x 8.6: TAB 0,2.6
SWITCH_TAC = smd 2.8 x 2.16: 1 -2.4,0.005; 2 2.4,0.005
TERMINAL_BLOCK_2 = smd 1.4 x 3.4: 1 1.25,-3.15; 2 -1.25,-3.15 | smd 2.3 x 5.6: P$1 4.2,0; P$2 -4.2,0
LQFP-48 = smd 1.143 x 0.254: 1 -4.25,2.75; 2 -4.25,2.25; 3 -4.25,1.75; 4 -4.25,1.25; 5 -4.25,0.75; 6 -4.25,0.25; 7 -4.25,-0.25; 8 -4.25,-0.75; 9 -4.25,-1.25; 10 -4.25,-1.75; 11 -4.25,-2.25; 12 -4.25,-2.75; 25 4.25,-2.75; 26 4.25,-2.25; 27 4.25,-1.75; 28 4.25,-1.25; 29 4.25,-0.75; 30 4.25,-0.25; 31 4.25,0.25; 32 4.25,0.75; 33 4.25,1.25; 34 4.25,1.75; 35 4.25,2.25; 36 4.25,2.75 | smd 0.254 x 1.143: 13 -2.75,-4.25; 14 -2.25,-4.25; 15 -1.75,-4.25; 16 -1.25,-4.25; 17 -0.75,-4.25; 18 -0.25,-4.25; 19 0.25,-4.25; 20 0.75,-4.25; 21 1.25,-4.25; 22 1.75,-4.25; 23 2.25,-4.25; 24 2.75,-4.25; 37 2.75,4.25; 38 2.25,4.25; 39 1.75,4.25; 40 1.25,4.25; 41 0.75,4.25; 42 0.25,4.25; 43 -0.25,4.25; 44 -0.75,4.25; 45 -1.25,4.25; 46 -1.75,4.25; 47 -2.25,4.25; 48 -2.75,4.25
CRYSTAL_5X3 = smd 1.7 x 2.4: 1 -1.85,0; 2 1.85,0
XBEE_WIFI = smd 2.845 x 1.524: 1 -10.744,9.195; 2 -10.744,7.188; 3 -10.744,5.182; 4 -10.744,3.175; 5 -10.744,1.168; 6 -10.744,-0.838; 7 -10.744,-2.845; 8 -10.744,-4.851; 9 -10.744,-6.858; 10 -10.744,-8.865; 11 -10.744,-10.871; 12 -10.744,-12.878; 13 -10.744,-14.884; 22 10.744,-14.884; 23 10.744,-12.878; 24 10.744,-10.871; 25 10.744,-8.865; 26 10.744,-6.858; 27 10.744,-4.851; 28 10.744,-2.845; 29 10.744,-0.838; 30 10.744,1.168; 31 10.744,3.175; 32 10.744,5.182; 33 10.744,7.188; 34 10.744,9.195; 35 10.744,11.201; 36 10.744,13.208; 37 10.744,15.215 | smd 1.524 x 2.845: 14 -7.023,-16.637; 15 -5.016,-16.637; 16 -3.01,-16.637; 17 -1.003,-16.637; 18 1.003,-16.637; 19 3.01,-16.637; 20 5.016,-16.637; 21 7.023,-16.637
SMD_DIODE = smd 1.2 x 0.7: A 1.85,0; C -1.85,0

### Placement (x,y rotation side)
B1  99.12,41.2 90 top
C1  35.73,6.43 0 top
C2  49.7,25.22 270 top
C3  56.75,25.22 270 top
C4  52.37,9.17 180 top
C5  56.39,3.82 270 top
C6  34.34,22.39 180 top
C7  48.98,3.82 270 top
C8  59.05,14.93 0 top
C9  54.65,22.1 90 top
C10  51.56,22.1 90 top
C11  52.38,3.62 270 top
C12  45.69,4.82 90 top
C13  54.81,8.32 270 top
C14  14.91,2.26 270 top
C15  22.51,2.26 270 top
C16  14.71,23.46 180 top
C17  11.21,4.66 180 top
C18  12.01,22.56 90 top
C19  24.21,23.24 0 top
C21  46.67,10.38 180 top
C22  46.51,24.7 270 top
C23  34.34,34.1 0 top
C24  34.64,46.5 90 top
C25  33.24,46.5 90 top
C26  68.99,11.46 0 top
C27  69.81,19.76 0 top
C28  66.93,27.01 0 top
C29  72.71,20.88 270 top
C30  62.77,13.68 180 top
C31  62.76,20.29 180 top
C32  62.79,15.28 180 top
C33  71.81,18.09 180 top
C34  71.76,12.93 180 top
C35  67.19,20.77 270 top
C36  66.38,10.56 270 top
C37  64.38,10.52 270 top
C38  83.6,32.34 180 top
C39  100.43,26.39 270 top
C40  87.99,19.22 180 top
C41  83.6,49.93 180 top
C42  2.69,52.58 270 top
C43  1.32,50.75 270 top
D1  57.37,42.74 90 top
D2  72.86,42.64 90 top
E_CLK  29.88,47.1 0 top
FB1  71.68,23.53 180 top
FB2  71.78,16.44 0 top
FB3  71.8,14.54 0 top
HD1  5.71,12.46 90 top
HD2  34.23,29.2 90 top
IC1  19.51,13.96 0 top
IC2  34.09,14.48 270 top
JP1  3.69,3.7 0 top
JP2  STAND-OFF  [STAND-OFF]  74.81,3.7 0 top
JP3  76.48,60.8 0 top
L1  85.23,7.57 90 top
LED1  9.78,6.96 0 top
LED2  36.94,46.3 270 top
LED3  81.44,20.94 0 top
MAX1  66.91,15.44 270 top
MCU1  34.34,39.8 270 top
OPTO1  52.89,37.17 270 top
OPTO2  68.48,37.07 270 top
R1  36.54,23.27 90 top
R2  59.02,12.17 180 top
R3  31.47,6.48 0 top
R4  30.89,23.24 90 top
R5  53.2,24.5 0 top
R6  38.09,23.26 90 top
R7  45.65,14.75 0 top
R8  45.65,13.3 0 top
R9  59.07,16.47 180 top
R10  8.51,19.96 90 top
R12  6.78,6.96 0 top
R13  59.07,18.02 180 top
R14  56.37,7.1 90 top
R15  48.98,7.1 90 top
R16  52.39,6.9 90 top
R17  38.64,49.6 90 top
R18  38.24,46.4 90 top
R19  62.75,17.18 180 top
R20  62.73,18.78 180 top
R21  65.18,21.24 270 top
R22  47.15,33.43 90 top
R23  50.97,47.84 180 top
R24  59.17,42.84 270 top
R25  62.64,33.33 90 top
R26  66.36,47.84 180 top
R27  74.66,42.64 270 top
R28  83.44,22.94 0 top
R29  41.11,47.5 90 top
R30  42.81,47.5 90 top
R31  2.59,44.3 270 top
REG1  98.76,9.11 180 top
RESET  33.84,51.3 0 top
RESET_WIFI  4.51,21.86 90 top
TB1  50.97,55.84 0 top
TB2  68.06,55.84 0 top
TB3  99.26,55.78 0 top
TB4  64.91,3.8 180 top
VS1011  52.39,15.58 180 top
X1  53.21,26.86 0 top
X2  18.71,2.46 0 top
XBEEWIFI  15.7,46.02 0 top
Z1  98.44,19.94 180 top

### Tracks (layer width: path | path; a pad name or v marks a point on that pad's centre or on a via)
3.3V  (via drill 0.6)
  Top 0.203: VS1011.14 C9.1 | VS1011.32 49.48,14.83 v49.81,15.16 | VS1011.6 57.75,15.33 C8.1 58.15,13.62 v58.21,13.56 | VS1011.43 52.64,12.39 53.01,12.76 53.21,12.76 53.61,12.36 53.61,11.36 VS1011.45 53.64,10.49 arc45 53.71,10.32 C13.1 54.87,9.36 v56.21,9.36 | VS1011.38 50.14,10.49 50.01,10.36 48.01,10.36 arc45 47.96,10.38 C21.1 47.48,10.29 arc45 47.41,10.12 v47.41,8.96 | VS1011.19 52.14,20.52 arc45 52.06,20.69 C10.1 | IC2.6 34.91,22.07
  Top 0.254: R6.2 R1.2 v35.12,24.17 v35.11,24.16 34.71,24.56 31.81,24.56 31.39,24.14 R4.2 | 34.91,22.32 C6.1 34.91,22.07 | MAX1.5 66.16,18.35 65.18,19.33 R21.2 65.18,21.13 65.11,21.2 64.51,21.2 64.31,21.4 64.01,21.4 v63.81,21.6 | 82.44,20.14 v81.54,19.24 | R28.2 84.34,19.32 C40.+ | HD1.2 4.77,9.92 v4.81,9.96 | R31.2 2.59,42.16 v2.64,42.11 | IC2.3 36.56,20.02 36.31,19.76 35.21,19.76 34.91,20.06 IC2.6
  Top 0.305: R3.2 33.59,6.48 v33.61,6.46 33.64,6.43 C1.1 34.61,6.65 34.61,6.96 34.36,7.21 IC2.22 | MCU1.4 34.74,45.6 C24.1 | MCU1.6 33.14,45.6 C25.1 | MCU1.18 v32.34,37 | OPTO1.VCC 55.44,35.21 v55.47,35.24 | OPTO2.VCC 71.03,35.07 v70.96,35.14
  Top 0.406: IC1.64 12.11,21.76 C18.1 v10.61,21.66 9.81,20.86 R10.2 | IC1.21 16.71,4.66 C17.1 12.11,6.36 v12.01,6.46 | C24.1 C25.1 | 33.14,45.6 32.44,45.6 v31.94,46.1 | v56.01,21.56 55.65,21.2 C9.1 | 46.69,22.88 arc45 C22.+ 47.31,22.95 arc-45 47.49,22.88 v48.41,21.96 48.73,21.63 arc45 48.91,21.56 50.41,21.56 50.69,21.27 arc45 50.87,21.2 C10.1 | R22.2 47.15,35.72 v47.27,35.84 | R25.2 62.64,35.62 v62.76,35.74 | C6.1 35.24,24.03 v35.11,24.16 | R29.2 41.11,49.9 40.76,50.25 | 40.76,50.25 40.71,50.3 38.84,50.3 R17.2 v38.64,51.8 | R30.2 42.81,50 42.51,50.3 40.81,50.3 40.76,50.25 | HD2.2 33.18,26.66 v33.44,26.4 | v23.33,24.57 23.31,24.55 C19.1 23.11,23.04 IC1.52
  Top 0.61: XBEEWIFI.2 4.49,53.48 C42.1 2.15,52.93 1.42,52.93 v1.32,52.83 C43.1
  Top 0.813: C12.+ 45,6.57 v44.01,7.56 | C40.+ 84.44,13.34 L1.2 86.62,13.94 96.44,13.94 97.06,14.56 REG1.4
  Top 1.93: C40.+ 84.44,19.24 v81.54,19.24 v78.84,19.24
  other vias: 80.24,19.24
  pour 3.3V: -0.76,0 105.51,0 105.51,64 71.84,64 71.84,54.49 -0.76,54.59
AUDIO_OUT+  (via drill 0.6)
  Top 0.813: C33.1 72.88,17.92 FB2.2 74.45,16.44 v74.51,16.5 | v61.81,7.8 62.86,7.8 TB4.1
  Bottom 0.813: v74.51,16.5 74.51,7.7 74.11,7.3 62.31,7.3 v61.81,7.8
AUDIO_OUT-
  Top 0.813: FB3.2 72.9,13.17 C34.1 72.66,8.15 72.51,8 67.26,8 TB4.2
BELL_MISO  (via drill 0.6)
  Top 0.203: VS1011.30 43.84,15.83 arc-45 43.66,15.9 v43.41,16.16 43.35,16.1 v40.31,16.1 39.71,16.7 30.71,16.7 30.41,17 v29.71,17 | IC2.14 29.74,20.93 v29.61,20.9
  Top 0.254: 30.14,37 MCU1.16 30.05,36.11 v29.84,35.9 | v38.84,35.9 39.34,35.9 39.74,35.5 39.74,27.4 38.74,26.4 37.25,26.4 HD2.1
  Bottom 0.203: v38.84,35.9 39.71,35.9 40.61,35 40.61,16.4 v40.31,16.1 | v29.71,17 29.71,20.8 v29.61,20.9
  Bottom 0.254: v38.84,35.9 v29.84,35.9
BELL_MOSI  (via drill 0.6)
  Top 0.203: VS1011.29 44.74,16.33 arc-45 44.56,16.4 v43.41,17.56 43.37,17.6 v39.71,17.6 v31.11,17.6 | IC2.13 31.06,19.86 v30.71,19.5
  Top 0.254: MCU1.15 31.14,37.8 31.24,37.7 31.24,36.7 30.74,36.2 30.74,35.6 v29.84,34.7 29.34,34.7 28.94,34.3 28.94,29.4 29.54,28.8 31.4,28.8 HD2.4
  Bottom 0.203: 38.91,34.7 39.91,33.7 39.91,17.8 v39.71,17.6 | v31.11,17.6 31.11,19.1 v30.71,19.5
  Bottom 0.254: v29.84,34.7 v38.84,34.7 38.91,34.7
BELL_RESET  (via drill 0.6)
  Top 0.254: 37.34,39.8 37.74,40.2 MCU1.29 | 37.34,39.8 37.34,36.8 37.84,36.3 37.84,32.06 HD2.5 | 37.34,39.8 v37.04,39.5 | 39.54,48 v39.54,47.2
  Top 0.305: RESET.2 36.51,51.01 36.51,49 37.01,48.5 38.44,48.5 R17.1 38.84,48.7 39.54,48
  Bottom 0.254: v37.04,39.5 37.04,45.2 39.04,47.2 v39.54,47.2
BELL_SCK  (via drill 0.6)
  Top 0.203: VS1011.28 45.64,16.83 arc-45 45.46,16.9 v43.41,18.96 42.95,18.5 39.11,18.5 38.91,18.7 v38.91,18.8 38.61,18.5 31.51,18.5 | IC1.46 28.27,18.36 28.41,18.5 31.51,18.5 | IC2.12 31.61,18.6 31.51,18.5
  Top 0.254: MCU1.17 31.54,34.13 30.91,33.5 v29.81,33.5 | v38.81,33.5 38.81,29.3 38.51,29 37.31,29 HD2.3
  Bottom 0.203: v38.81,33.5 38.81,33.2 39.41,32.6 39.41,19.3 v38.91,18.8
  Bottom 0.254: v38.81,33.5 v29.81,33.5
EXT_CLK
  Top 0.254: MCU1.7 32.34,44.88 32,45.21 30.79,45.21 29.87,46.13 E_CLK.1
FBELL_BUTTON
  Top 0.203: MCU1.32 42.6,42.6 42.98,42.98 43.89,42.98 45.92,40.95 46.02,40.84 46.11,40.76 46.11,33 46.51,32.6 47.08,32.6 R22.1
  Top 0.406: R22.1 50.27,32.53 OPTO1.OUT
FBELL_EVENT  (via drill 0.6)
  Top 0.203: MCU1.9 v30.05,43.66
  Top 0.254: IC1.2 12.84,19.16 13.82,18.19 24.8,18.19 v24.82,18.2
  Bottom 0.203: v24.82,18.2 24.89,18.28 24.89,19.71 26.01,20.83 26.01,26.11 26.62,26.72 26.62,39.83 30.05,43.26 v30.05,43.66
GND  (via drill 0.6)
  Top 0.203: R13.1 R9.1 59.97,14.95 C8.2 59.95,13.62 v60.01,13.56 | C5.2 56.39,1.58 v56.41,1.36 | C7.2 48.98,1.59 v48.91,1.36 | v60.02,13.55 v60.01,13.56 | R2.1 59.92,13.47 v60.01,13.56 | R8.1 43.47,13.3 v43.41,13.36 | R7.1 v43.42,14.75 v43.41,14.76 | VS1011.4 55.34,14.33 arc-45 55.16,14.4 v55.01,14.56 | VS1011.41 51.64,9.45 arc-45 51.56,9.27 C4.2 | C11.2 52.38,1.43 arc45 v52.41,1.36 | C13.2 v54.81,6.16 | C21.2 arc-45 45.72,10.36 v44.21,10.36
  Top 0.254: IC2.21 v33.81,9.55 v33.81,9.56 | VS1011.16 53.64,18.19 v53.61,18.16 | VS1011.21 51.14,18.23 v51.21,18.16 | VS1011.20 51.64,18.59 v51.21,18.16 | VS1011.22 50.64,18.73 v51.21,18.16 | VS1011.37 49.64,12.79 v49.81,12.96 | VS1011.40 51.14,12.49 v51.41,12.76 51.64,12.53 VS1011.41 | VS1011.47 54.64,12.73 v53.21,14.16 | MAX1.3 67.16,15.15 v67.48,14.83 | MAX1.10 67.07,15.24 | MAX1.11 66.78,14.74 67.39,14.74 | MAX1.22 67.48,15.74 v67.48,14.83 | MAX1.21 67.48,15.24 v67.48,14.83 | LED3.C v79.54,20.94 | IC2.7 34.36,22.05 34.01,22.4 C6.2 | RESET_WIFI.1 4.53,15.24 v4.81,14.96 4.77,15 HD1.6
  Top 0.305: C1.2 37.88,6.43 v37.91,6.46 | C23.2 34.74,34.6 MCU1.21 v34.74,37 | MCU1.5 v33.94,42.6 | MCU1.3 v35.54,42.6 | 67.39,14.74 v67.48,14.83 | 67.07,15.24 67.07,15.03 66.78,14.74 | IC1.63 14.31,20.86 | RESET.1 31.44,51.2 v33.94,48.7 | OPTO1.GND 52.9,35.21 v52.87,35.24 | OPTO2.GND 68.49,35.01 v68.36,35.14 | R12.1 5.88,6.63 v6.82,5.69
  Top 0.406: IC1.53 v22.31,20.06 | IC1.63 14.31,22.96 C16.2 C18.2 | C17.2 v8.91,4.66 | IC1.22 v17.51,7.96 | C14.2 v13.41,1.36 | C15.2 v23.91,1.36 | R18.1 v38.24,44.2 | C24.2 34.64,48 v33.94,48.7 33.24,48 C25.2 | C3.2 56.75,23.7 v56.01,22.96 55.97,23 C9.2 | C10.2 50.15,23 arc45 49.97,22.93 v49.81,22.76 49.77,22.8 arc-45 49.7,22.98 C2.2 | C6.2 33.44,23.23 v33.01,23.66 | 14.31,20.86 v15.11,20.06 | HD2.6 33.1,31.74 v33.44,31.4 | C19.2 v25.11,24.54
  Top 0.61: v1.32,48.51 C43.2 1.49,49.85 2.64,51 2.64,51.63 C42.2 | XBEEWIFI.22 25.2,29.77 v25.2,28.45 | v29.01,54.05 28.96,54.1 28.96,56.39 28.12,57.23 XBEEWIFI.35 | XBEEWIFI.11 v2.64,35.15 | XBEEWIFI.13 2.69,31.14 v2.64,31.19 | XBEEWIFI.1 2.39,55.22 v1.32,54.15
  Top 0.813: C2.2 48.64,24.32 C22.- | C12.- 45.69,3.04 v44.21,1.56 | C33.2 C27.2 | C27.2 70.91,21.4 v70.88,21.43 | C37.2 v62.79,9.62 v62.78,9.63 62.58,9.83 v62.58,11.63 61.87,12.34 C30.2 61.87,15.26 C32.2 | C34.2 70.86,12.23 C26.2 v70.09,9.84 v70.08,9.83 | v62.08,25.03 62.08,25.71 C28.- | C29.2 70.93,19.78 C27.2 | v98.74,14.44 98.76,14.44 REG1.3 98.76,19.62 98.44,19.94 Z1.A 95.44,19.94 95.34,19.84 95.34,17 REG1.5 | C40.- 91.54,20.24 v92.74,21.44 | C41.- 93.83,49.93 v93.84,49.94 | C38.- v93.84,32.34
  Top 1.27: C39.- 101.24,29.94 v102.74,31.44 | B1.- 101.67,34.44 v101.74,34.44
  other vias: 66.38,16.03 102.74,9.44 94.74,9.44 94.74,3.44 102.74,3.44 100.74,7.44 96.74,7.44 96.74,5.44 100.74,5.44 98.77,9.37 98.87,3.48
  pour GND: -0.76,0 105.51,0 105.51,64 71.84,63.9 71.84,54.49 -0.76,54.49
  pour Top (isolate 0.406): -1.27,54.61 3.81,54.61 3.81,27.94 27.94,27.94 27.94,54.61 71.73,54.61 71.73,66.14 106.68,66.14 106.68,-1.27 -1.27,-1.27
  pour Bottom (isolate 0.406): -1.27,54.61 71.73,54.61 71.73,66.14 106.68,66.14 106.68,-1.27 -1.27,-1.27
MCU_RESET  (via drill 0.6)
  Top 0.254: HD1.5 8.51,15.22 v8.51,16.96 R10.1 7.45,19.06 6.51,20 6.51,23 5.51,24 4.79,24 RESET_WIFI.2 | IC1.20 v15.91,7.96
  Bottom 0.254: v15.91,7.96 10.53,7.96 8.64,9.86 8.64,16.83 v8.51,16.96
MEM_GRANT  (via drill 0.6)
  Top 0.203: IC1.47 28.27,19.16 28.41,19.3 28.41,21 v28.31,21.1 | MCU1.12 31.18,40.2 v31.62,39.76
  Bottom 0.203: v28.31,21.1 28.51,21.3 28.51,36.64 v31.62,39.76
MEM_IO0
  Top 0.203: IC2.17 31.61,8.7 30.81,9.5 27.37,9.5 IC1.35
MEM_IO1
  Top 0.203: IC2.18 32.16,8.74 30.61,10.3 27.37,10.3 IC1.36
MEM_IO2
  Top 0.203: IC2.19 32.71,8.79 30.31,11.2 27.35,11.2 IC1.37
MEM_IO3
  Top 0.203: IC2.20 33.26,8.95 30.21,12 27.35,12 IC1.38
MEM_IO4
  Top 0.203: IC2.23 34.91,9.6 31.71,12.8 27.35,12.8 IC1.39
MEM_IO5
  Top 0.203: IC2.24 35.46,9.64 31.51,13.6 27.35,13.6 IC1.40
MEM_IO6
  Top 0.203: IC2.25 36.01,9.79 31.41,14.4 27.35,14.4 IC1.41
MEM_IO7
  Top 0.203: IC2.26 36.56,9.95 31.31,15.2 27.35,15.2 IC1.42
MEM_RDY  (via drill 0.6)
  Top 0.203: IC1.44 28.05,16.76 29.11,15.7 31.51,15.7 32.41,14.8 v37.61,14.8 | v38.51,21 38.44,20.93 IC2.1 37.66,21.93 R6.1 38.13,22.4 39.01,22.4 39.11,22.5 39.11,24.9 38.81,25.2 35.81,25.2 35.51,25.5 35.51,32.5 35.71,32.7 36.81,32.7 37.14,33.03 MCU1.24
  Bottom 0.203: v38.51,21 38.51,20.6 37.61,19.7 v37.61,14.8
MEM_REQ  (via drill 0.6)
  Top 0.203: IC1.48 27.31,22 v27.62,22.31 | MCU1.11 31.67,41 v31.68,41.01
  Bottom 0.203: v31.68,41.01 28.04,37.37 28.04,22.73 v27.62,22.31
MEM_RESET  (via drill 0.6)
  Top 0.203: MCU1.28 40.01,39.4 v40.41,39.8 | v42.11,19.7 37.31,19.7 37.11,19.9 IC2.2
  Top 0.254: IC2.2 37.11,21.8 R1.1
  Bottom 0.203: v40.41,39.8 40.41,38.5 41.61,37.3 41.61,20.2 v42.11,19.7
MEM_SB  (via drill 0.6)
  Top 0.203: v29.01,6.5 30.55,6.5 R3.1 | MCU1.23 36.34,33.53 36.01,33.2 35.21,33.2 34.61,32.6 34.61,26.43 v34.64,26.4
  Top 0.305: IC2.16 31.06,6.97 R3.1
  Bottom 0.203: v34.64,26.4 34.64,25.63 34.11,25.1 34.11,13.3 29.01,8.2 v29.01,6.5
MEM_SEL  (via drill 0.6)
  Top 0.203: IC1.45 27.95,17.56 29.31,16.2 32.31,16.2 v32.81,15.7 | v32.81,19.4 32.21,20 32.21,20.89 IC2.11 | R4.1 29.57,22.34 v29.51,22.4 | MCU1.13 30.71,39.4 v31.61,38.51
  Top 0.254: IC2.11 32.16,21.8 32.01,21.96 31.27,21.96 R4.1
  Bottom 0.203: v32.81,15.7 v32.81,19.4 | v29.51,22.4 29.01,22.9 29.01,36.22 31.29,38.51 v31.61,38.51
MISO  (via drill 0.6)
  Top 0.254: HD1.1 8.82,10.36 IC1.13 13.81,10.36 13.82,10.36 v14.22,10.36 | XBEEWIFI.17 14.73,29.18 v14.73,27.03
  Bottom 0.254: v14.22,10.36 14.22,26.62 14.63,27.03 v14.73,27.03
MOSI  (via drill 0.6)
  Top 0.254: HD1.4 3.97,11.16 IC1.12 12.99,11.16 v13.21,11.38 | XBEEWIFI.16 12.7,29.21 v12.7,27.03
  Bottom 0.254: v13.21,11.38 13.21,26.62 12.8,27.03 v12.7,27.03
MUTE
  Top 0.254: MAX1.4 66.66,18.65 66.18,19.13 66.18,21.63 65.71,22.1 65.22,22.1 R21.1 64.42,22.9 58.91,22.9 58.61,23.2 58.61,27.7 57.21,29.1 44.31,29.1 44.11,29.3 44.11,36 43.41,36.7 39.61,36.7 39.31,37 MCU1.25
N$1
  Top 0.254: IC1.23 18.31,3.91 X2.1
  Top 0.406: C14.1 16.16,3.16 X2.1
N$2
  Top 0.254: IC1.24 19.11,3.91 X2.2
  Top 0.406: C15.1 21.26,3.16 X2.2
N$3  (via drill 0.6)
  Top 0.254: MAX1.17 67.66,11.69 | 68.16,11.73 MAX1.18 68.82,13.49 v69.28,13.03
  Top 0.305: 67.66,11.69 C26.1 68.16,11.73 | MAX1.1 68.19,17.44 68.58,17.83 68.58,19.63 C27.1
  Top 0.406: v69.08,21.93 68.88,21.93 68.33,21.38
  Top 0.813: C27.1 68.78,19.83 68.78,20.93 68.33,21.38 67.84,21.87 C35.1 67.19,23.72 70.09,26.62 | 70.09,26.62 C28.+ | FB1.2 70.58,26.13 70.09,26.62
  Bottom 0.305: 69.28,21.73 v69.08,21.93
  Bottom 0.406: v69.28,13.03 69.28,21.73
N$4
  Top 0.305: LED1.C R12.2
N$5
  Top 0.305: IC1.16 11.53,7.96 LED1.A
N$7
  Top 0.305: MCU1.20 33.94,34.6 C23.1
N$8
  Top 0.406: IC1.62 15.11,22.96 C16.1
N$12
  Top 0.254: MAX1.12 64.18,14.19 C30.1
N$14
  Top 0.254: MAX1.8 62.84,16.19 R19.2
N$15
  Top 0.254: R20.2 62.53,18.78 62.68,18.63 62.68,18.03 63.18,17.53 63.3,17.53 R19.1 64.47,17.18 MAX1.7
N$16
  Top 0.254: R20.1 63.63,20.26
  Top 0.305: 63.63,20.26 C31.1 | MAX1.6 65.66,17.55 64.38,18.83 63.68,18.83 R20.1
N$17
  Top 0.305: LED2.C 37.99,47.05 R18.2
N$18
  Top 0.305: MCU1.2 36.34,44.95 LED2.A
N$19
  Top 0.254: MAX1.9 64.1,15.69 C32.1
N$20
  Top 0.254: MAX1.20 70.55,14.69 FB3.1 70.35,14.19 MAX1.19
N$21
  Top 0.254: MAX1.23 70.43,16.19 FB2.1 70.43,16.69 MAX1.24
N$22
  Top 0.254: MAX1.2 67.66,19.2
  Top 0.305: 67.66,19.2 C35.2
N$23
  Top 0.254: MAX1.16 67.16,12.41 66.68,11.93 66.68,11.76 C36.1
N$24
  Top 0.254: C36.2 65.38,10.66 65.38,12.33 65.58,12.53 66.38,12.53 66.66,12.81 MAX1.15
N$25
  Top 0.305: MAX1.14 MAX1.13 65.59,13.54 64.38,12.33 C37.1
N$26
  Top 0.406: 55.72,41.9 OPTO1.A 57.37,41.67 | D1.C 57.37,41.67 | 57.37,41.67 57.37,41.14 57.51,41 59.03,41 R24.2
N$27
  Top 0.406: 71.21,41.8 OPTO2.A 72.86,41.57 D2.C 73.66,40.94 R27.2
N$28
  Top 0.203: VS1011.18 52.64,21.29 arc-45 52.71,21.46 53.01,21.76 53.01,23.68 arc45 52.93,23.86 R5.1
  Top 0.406: R5.1 52.01,24.5 51.51,25 51.51,26.71 X1.1 50.62,26.12 C2.1
N$29
  Top 0.203: VS1011.17 53.14,20.98 arc-45 53.21,21.16 53.61,21.56 53.61,23.91 arc-45 53.68,24.08 R5.2
  Top 0.406: R5.2 54.41,24.5 54.81,24.9 54.81,26.61 X1.2 55.8,26.12 C3.1
N$30
  Top 0.203: VS1011.44 53.14,9.4 arc45 53.21,9.23 C4.1
N$31
  Top 0.813: L1.1 85.23,4.73 92.44,11.94 99.44,11.94 100.44,12.94 100.44,16.96 REG1.2 100.46,19.79 100.31,19.94 Z1.C
N$32
  Top 0.203: VS1011.10 57.48,17.33 R13.2
N$33
  Top 0.203: VS1011.9 57.81,16.83 R9.2
N$34
  Top 0.203: VS1011.34 47.38,13.83 arc45 47.2,13.76 47.01,13.56 46.91,13.56 arc45 46.73,13.49 R8.2
N$35
  Top 0.203: VS1011.33 46.97,14.33 R7.2
N$36
  Top 0.254: R28.1 82.19,22.59 LED3.A
N$37
  Top 0.406: R24.1 59.17,44.64 R23.1
  Top 1.27: 55.51,47.4 55.53,47.4 55.62,47.49 | 55.62,47.49 R23.1 | TB1.1 52.17,50.04 54.61,47.6 55.51,47.6 55.62,47.49
N$39
  Top 0.406: R27.1 74.66,44.54 R26.1
  Top 1.27: TB2.1 69.26,49.94 R26.1
N$41
  Top 0.203: R14.1 56.37,4.74 C5.1
N$42
  Top 0.203: R15.1 C7.1
N$43
  Top 0.203: C11.1 52.39,4.73 R16.1
RBELL_BUTTON
  Top 0.203: MCU1.1 37.14,43.97 37.81,43.3 42.21,43.3 42.39,43.48 44.09,43.48 50.58,37 57.21,37 61.71,32.5 62.57,32.5 R25.1
  Top 0.406: R25.1 65.76,32.43 OPTO2.OUT
RBELL_EVENT  (via drill 0.6)
  Top 0.203: MCU1.10 29.95,41.7 31.17,41.7 v31.68,42.21
  Top 0.254: IC1.1 13.45,19.96 14.21,19.2 v25.71,19.2
  Bottom 0.203: v31.68,42.21 27.64,38.17 27.64,23.82 26.67,22.86 26.67,20.16 v25.71,19.2
SCK  (via drill 0.6)
  Top 0.254: IC1.11 8.88,11.96 HD1.3 6.23,12.46 v6.2,12.5 | XBEEWIFI.14 8.74,29.16 v8.74,27.03
  Bottom 0.254: v6.2,12.5 6.2,24.59 8.64,27.03 v8.74,27.03
TRANS1  (via drill 0.6)
  Top 0.813: R23.2 46.67,47.84 v49.51,45 | v98.81,46.8 101.67,46.8 | R26.2 61.36,45.15 v61.51,45
  Top 1.27: TB3.1 101.67,51.32 101.67,46.8 B1.AC2
  Bottom 0.813: v49.51,45 v61.51,45 97.01,45 v98.81,46.8
TRANS2  (via drill 0.6)
  Top 0.406: D2.A 69.35,43.54 68.41,42.6 68.41,42.3 | 68.41,42.3 68.41,41.6 OPTO2.C | TB1.2 49.67,47.84 52.91,44.6 52.91,43.2 | 52.91,43.2 52.91,41.71 OPTO1.C | D1.A 53.35,43.64 52.91,43.2 | TB2.2 66.76,43.95 68.41,42.3
  Top 0.813: TB1.2 49.2,52.69 48.51,52 v47.51,52 | TB2.2 66.3,52.79 65.51,52 v64.51,52 | v94.71,51.7 94.87,51.7 96.57,50
  Top 1.27: TB3.2 96.57,51.14 96.57,50 B1.AC1
  Bottom 0.813: v47.51,52 v64.51,52 94.41,52 v94.71,51.7
VCC
  Top 0.813: C29.1 72.71,23.46 FB1.1 | REG1.1 102.16,21.11 C39.+
  Top 1.016: C38.+ 77.31,32.28 77.31,25.1 75.84,23.63 75.84,23.53 FB1.1
  Top 1.27: C41.+ 77.25,36.94 | 77.25,36.94 C38.+ | C39.+ 96.57,26.7 B1.+ 96.57,36.94 77.25,36.94
VS_AUDIO_OUT_L
  Top 0.203: VS1011.46 54.14,10.73 arc45 54.21,10.56 54.41,10.36 56.5,10.36 arc-45 56.68,10.29 57.21,9.76 57.21,8.95 arc-45 57.13,8.77 R14.2
  Top 0.254: C31.2 61.2,20.29 60.91,20 60.91,8.8 60.11,8 R14.2
VS_AUDIO_OUT_R  (via drill 0.6)
  Top 0.203: VS1011.39 50.64,10.29 arc-45 50.56,10.12 49.01,8.56 49.01,8.07 arc-45 R15.2 50.06,8 arc-45 50.24,7.93 50.81,7.36 v50.81,1.36
VS_DREQ  (via drill 0.6)
  Top 0.203: VS1011.8 51.64,16.33 49.01,18.96 44.91,18.96 arc-45 44.73,19.03 v43.41,20.36 | MCU1.27 v41.71,38.6
  Bottom 0.203: v41.71,38.6 41.81,38.6 42.11,38.3 42.11,21.66 v43.41,20.36
VS_GBUF  (via drill 0.6)
  Top 0.203: VS1011.42 52.14,10.63 52.41,10.36 52.41,8.02 R16.2 | R16.2 52.25,8 52.46,8 arc-45 52.64,7.93 | R16.2 53.26,7.8 arc-45 53.44,7.73 53.61,7.56 53.61,2.27 arc45 53.68,2.09 v54.41,1.36
VS_RESET  (via drill 0.6)
  Top 0.203: VS1011.3 55.68,13.83 55.41,13.56 55.41,12.56 55.81,12.16 58.11,12.16 R2.2 58.01,12.06 58.01,11.56 57.61,11.16 v57.01,11.16 | MCU1.26 v40.01,37.8
  Bottom 0.203: v57.01,11.16 56.61,11.56 41.65,11.56 41.11,12.1 41.11,36.7 v40.01,37.8
VS_XCS  (via drill 0.6)
  Top 0.203: VS1011.23 50.14,20.52 arc45 50.06,20.7 49.81,20.96 45.71,20.96 arc-45 45.53,21.03 v43.41,23.16 | R30.1 42.81,45.7 v43.51,45 | MCU1.31 42.1,41.8 42.47,42.16 43.45,42.16 v43.51,42.1
  Bottom 0.203: v43.41,23.16 43.41,41.7 v43.51,42.1 v43.51,45
VS_XDCS  (via drill 0.6)
  Top 0.203: VS1011.13 56.54,19.83 | MCU1.30 v42.61,41 | R29.1 41.11,45.4 v41.51,45
  Top 0.254: 56.54,19.83 v56.61,19.76
  Bottom 0.203: v56.61,19.76 45.51,19.76 arc-45 45.33,19.83 v43.41,21.76 43.41,21.8 42.61,22.6 v42.61,41 41.51,42.1 v41.51,45
XBEE_ASSOC  (via drill 0.6)
  Top 0.203: v25.2,26.62 22.96,26.62 20.71,24.37 IC1.55 | XBEEWIFI.28 28.25,43.18 v28.75,43.69
  Bottom 0.203: v28.75,43.69 26.11,41.05 26.11,27.33 25.4,26.62 v25.2,26.62
XBEE_ATTN  (via drill 0.6)
  Top 0.254: IC1.57 19.11,24.38 18.09,25.4 8.94,25.4 6.81,27.53 v6.81,28.25
  Top 0.305: XBEEWIFI.12 2.72,33.15 v2.64,33.22
  Bottom 0.254: v2.64,33.22 2.64,32.61 6.81,28.45 v6.81,28.25
XBEE_DIO13
  Top 0.254: IC1.59 17.48,21.79 17.48,24.08 17.17,24.38 8.33,24.38 5.28,27.43 3.96,27.43 1.12,30.28 1.12,45.52 2.95,47.35 2.95,50.19 3.35,50.6 4.34,50.6 XBEEWIFI.3
XBEE_RESET
  Top 0.254: XBEEWIFI.6 | IC1.58 18.31,24.11 17.53,24.89 8.64,24.89 5.59,27.94 4.17,27.94 1.63,30.48 1.63,44.23 R31.1
  Top 0.305: XBEEWIFI.6 R31.1
XBEE_SEL
  Top 0.254: IC1.56 19.91,24.49 18.49,25.91 12.19,25.91 10.67,27.43 10.67,29.34 XBEEWIFI.15
XBEE_SLEEP  (via drill 0.6)
  Top 0.203: v26.82,25.6 22.66,25.6 21.51,24.45 IC1.54 | v28.65,40.54 28.45,40.34 28.45,39.37 28.25,39.17 XBEEWIFI.26
  Bottom 0.203: v28.65,40.54 27.13,39.01 27.13,25.91 v26.82,25.6

### Text on the board
tPlace: C | C | C | C | RESET | PWR
tNames: FRONT | REAR | TRANS | Doorbell / Ver. 3.0 | TB1 | TB2 | LED3 | VS1011 | Copyright 2013 / Kelly Flanagan | REG1
tSilk: C | + | -